# EAGLE design stackclock_display (EAGLE 6.6.0)

## Sheet 1 of 3: Logic
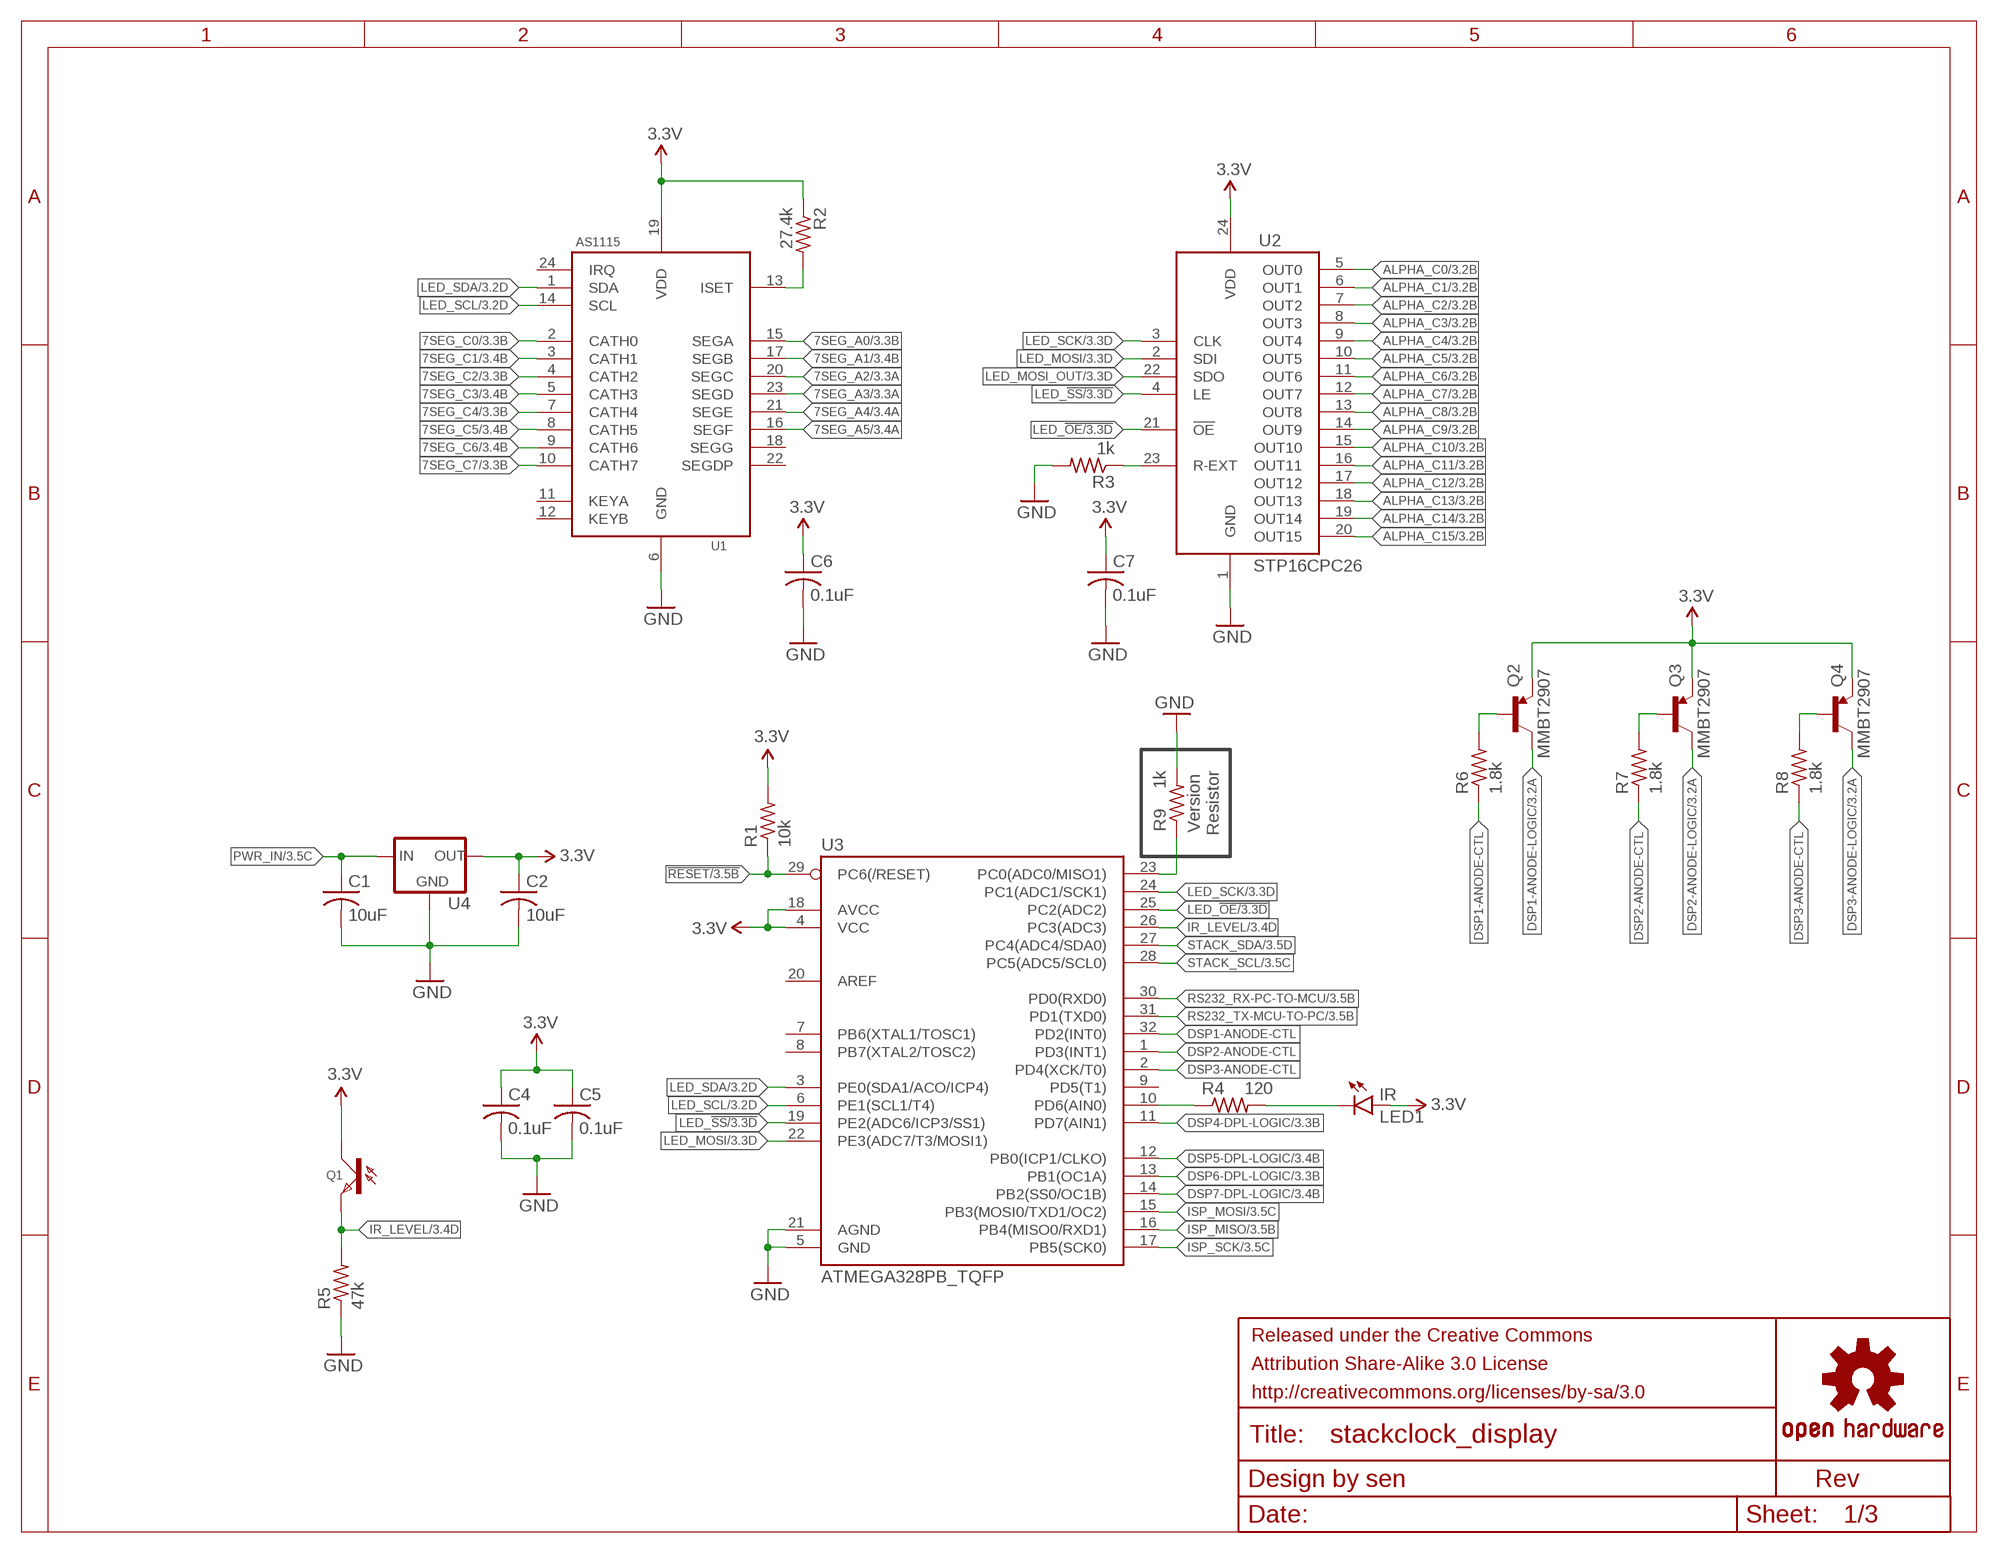
[diagram p0: schematic, sheet 1]

### Parts
C1  10uF  C-USC0805  [C0805]
C2  10uF  C-USC0805  [C0805]
C4  0.1uF  C-USC0603  [C0603]
C5  0.1uF  C-USC0603  [C0603]
C6  0.1uF  C-USC0603  [C0603]
C7  0.1uF  C-USC0603  [C0603]
FRAME1  FRAME-LETTER-GRID-OSHW-SENOSHW-LOGO-L  [OSHW-LOGO-L]
LED1  IR  LED1206  [LED-1206]
Q1  PT15-21C/TR8  [1206_PHOTOTRANSISTOR]
Q2  MMBT2907  TRANSISTOR_PNPSMD  [SOT23-3]
Q3  MMBT2907  TRANSISTOR_PNPSMD  [SOT23-3]
Q4  MMBT2907  TRANSISTOR_PNPSMD  [SOT23-3]
R1  10k  R-US_R0603  [R0603]
R2  27.4k  R-US_R0603  [R0603]
R3  1k  R-US_R0603  [R0603]
R4  120  R-US_R0603  [R0603]
R5  47k  R-US_R0603  [R0603]
R6  1.8k  R-US_R0603  [R0603]
R7  1.8k  R-US_R0603  [R0603]
R8  1.8k  R-US_R0603  [R0603]
R9  1k  R-US_R0603  [R0603]
U1  AS1115  [QSOP24]
U2  STP16CPC26  [TSSOP24]
U3  ATMEGA328PB_TQFP  [TQFP32-08]
U4  NCP1117DT33G  V_REG_MC33269DT  [DPAK]

### Nets
3.3V: C2.1 C4.1 C5.1 C6.1 C7.1 LED1.A Q1.C Q2.2(E) Q3.2(E) Q4.2(E) R1.2 R2.1 U1.19(VDD) U2.24(VDD) U3.4(VCC) U3.18(AVCC) U4.4(OUT) ; also sheet 3
7SEG_A0: U1.15(SEGA) ; also sheet 3
7SEG_A1: U1.17(SEGB) ; also sheet 3
7SEG_A2: U1.20(SEGC) ; also sheet 3
7SEG_A3: U1.23(SEGD) ; also sheet 3
7SEG_A4: U1.21(SEGE) ; also sheet 3
7SEG_A5: U1.16(SEGF) ; also sheet 3
7SEG_C0: U1.2(CATH0) ; also sheet 3
7SEG_C1: U1.3(CATH1) ; also sheet 3
7SEG_C2: U1.4(CATH2) ; also sheet 3
7SEG_C3: U1.5(CATH3) ; also sheet 3
7SEG_C4: U1.7(CATH4) ; also sheet 3
7SEG_C5: U1.8(CATH5) ; also sheet 3
7SEG_C6: U1.9(CATH6) ; also sheet 3
7SEG_C7: U1.10(CATH7) ; also sheet 3
!RESET: R1.1 U3.29(PC6(/RESET)) ; also sheet 3
ALPHA_C0: U2.5(OUT0) ; also sheet 3
ALPHA_C1: U2.6(OUT1) ; also sheet 3
ALPHA_C2: U2.7(OUT2) ; also sheet 3
ALPHA_C3: U2.8(OUT3) ; also sheet 3
ALPHA_C4: U2.9(OUT4) ; also sheet 3
ALPHA_C5: U2.10(OUT5) ; also sheet 3
ALPHA_C6: U2.11(OUT6) ; also sheet 3
ALPHA_C7: U2.12(OUT7) ; also sheet 3
ALPHA_C8: U2.13(OUT8) ; also sheet 3
ALPHA_C9: U2.14(OUT9) ; also sheet 3
ALPHA_C10: U2.15(OUT10) ; also sheet 3
ALPHA_C11: U2.16(OUT11) ; also sheet 3
ALPHA_C12: U2.17(OUT12) ; also sheet 3
ALPHA_C13: U2.18(OUT13) ; also sheet 3
ALPHA_C14: U2.19(OUT14) ; also sheet 3
ALPHA_C15: U2.20(OUT15) ; also sheet 3
DSP1-ANODE-CTL: R6.1 U3.32(PD2(INT0))
DSP1-ANODE-LOGIC: Q2.3(C) ; also sheet 3
DSP1-ANODE-QR: Q2.1(B) R6.2
DSP2-ANODE-CTL: R7.1 U3.1(PD3(INT1))
DSP2-ANODE-LOGIC: Q3.3(C) ; also sheet 3
DSP2-ANODE-QR: Q3.1(B) R7.2
DSP3-ANODE-CTL: R8.1 U3.2(PD4(XCK/T0))
DSP3-ANODE-LOGIC: Q4.3(C) ; also sheet 3
DSP3-ANODE-QR: Q4.1(B) R8.2
DSP4-DPL-LOGIC: U3.11(PD7(AIN1)) ; also sheet 3
DSP5-DPL-LOGIC: U3.12(PB0(ICP1/CLKO)) ; also sheet 3
DSP6-DPL-LOGIC: U3.13(PB1(OC1A)) ; also sheet 3
DSP7-DPL-LOGIC: U3.14(PB2(SS0/OC1B)) ; also sheet 3
GND: C1.2 C2.2 C4.2 C5.2 C6.2 C7.2 R3.2 R5.1 R9.2 U1.6(GND) U2.1(GND) U3.5(GND) U3.21(AGND) U4.1(GND) ; also sheet 3
HW_VERSION: R9.1 U3.23(PC0(ADC0/MISO1))
IR_CTL: R4.1 U3.10(PD6(AIN0))
IR_LEVEL: Q1.E R5.2 U3.26(PC3(ADC3)) ; also sheet 3
IR_R: LED1.C R4.2
ISP_MISO: U3.16(PB4(MISO0/RXD1)) ; also sheet 3
ISP_MOSI: U3.15(PB3(MOSI0/TXD1/OC2)) ; also sheet 3
ISP_SCK: U3.17(PB5(SCK0)) ; also sheet 3
LED_!OE: U2.21(!OE) U3.25(PC2(ADC2)) ; also sheet 3
LED_!SS: U2.4(LE) U3.19(PE2(ADC6/ICP3/SS1)) ; also sheet 3
LED_MOSI: U2.2(SDI) U3.22(PE3(ADC7/T3/MOSI1)) ; also sheet 3
LED_MOSI_OUT: U2.22(SDO) ; also sheet 3
LED_SCK: U2.3(CLK) U3.24(PC1(ADC1/SCK1)) ; also sheet 3
LED_SCL: U1.14(SCL) U3.6(PE1(SCL1/T4)) ; also sheet 3
LED_SDA: U1.1(SDA) U3.3(PE0(SDA1/ACO/ICP4)) ; also sheet 3
PWR_IN: C1.1 U4.3(IN) ; also sheet 3
RS232_RX-PC-TO-MCU: U3.30(PD0(RXD0)) ; also sheet 3
RS232_TX-MCU-TO-PC: U3.31(PD1(TXD0)) ; also sheet 3
STACK_SCL: U3.28(PC5(ADC5/SCL0)) ; also sheet 3
STACK_SDA: U3.27(PC4(ADC4/SDA0)) ; also sheet 3
U1-ISET: R2.2 U1.13(ISET)
U2-REXT: R3.1 U2.23(R-EXT)
Unconnected: U1.11(KEYA) U1.12(KEYB) U1.18(SEGG) U1.22(SEGDP) U1.24(IRQ) U3.7(PB6(XTAL1/TOSC1)) U3.8(PB7(XTAL2/TOSC2)) U3.9(PD5(T1)) U3.20(AREF)

### Notes on the sheet
- Version
  Resistor

## Sheet 2 of 3: Display
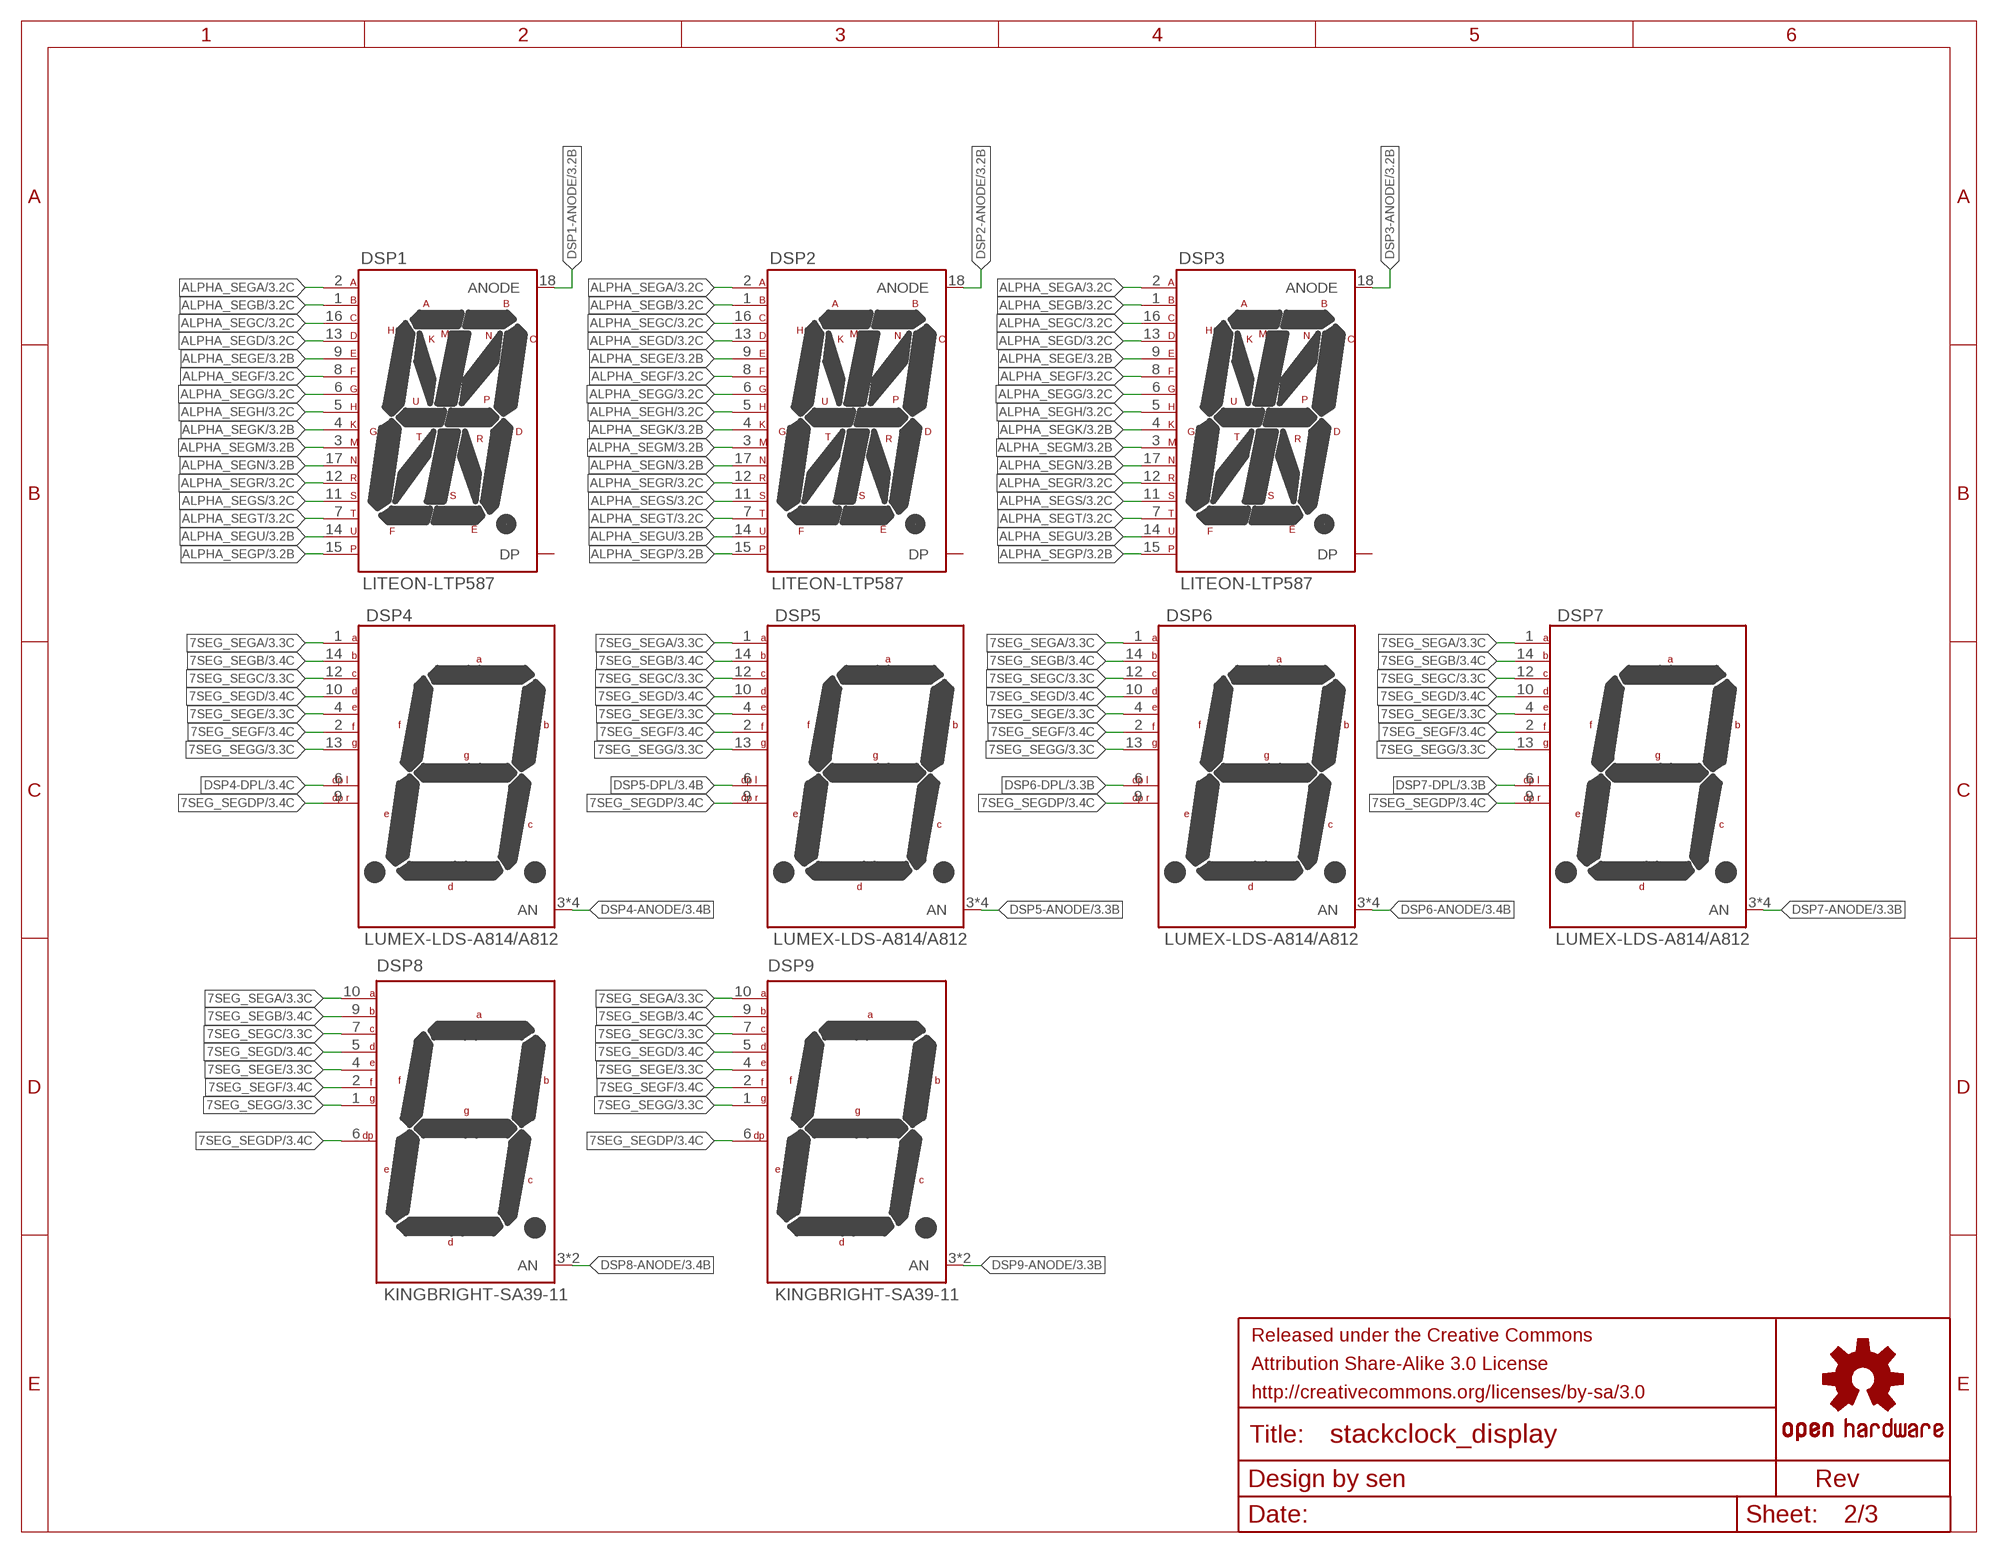
[diagram p1: schematic, sheet 2]

### Parts
DSP1  LITEON-LTP587  [LITEON-LTP587]
DSP2  LITEON-LTP587  [LITEON-LTP587]
DSP3  LITEON-LTP587  [LITEON-LTP587]
DSP4  LUMEX-LDS-A814/A812  [LUMEX-LDS-A814/A812]
DSP5  LUMEX-LDS-A814/A812  [LUMEX-LDS-A814/A812]
DSP6  LUMEX-LDS-A814/A812  [LUMEX-LDS-A814/A812]
DSP7  LUMEX-LDS-A814/A812  [LUMEX-LDS-A814/A812]
DSP8  KINGBRIGHT-SA39-11  [KINGBRIGHT-SA39-11]
DSP9  KINGBRIGHT-SA39-11  [KINGBRIGHT-SA39-11]
FRAME2  FRAME-LETTER-GRID-OSHW-SENOSHW-LOGO-L  [OSHW-LOGO-L]

### Nets
7SEG_SEGA: DSP4.1(A) DSP5.1(A) DSP6.1(A) DSP7.1(A) DSP8.10(A) DSP9.10(A) ; also sheet 3
7SEG_SEGB: DSP4.14(B) DSP5.14(B) DSP6.14(B) DSP7.14(B) DSP8.9(B) DSP9.9(B) ; also sheet 3
7SEG_SEGC: DSP4.12(C) DSP5.12(C) DSP6.12(C) DSP7.12(C) DSP8.7(C) DSP9.7(C) ; also sheet 3
7SEG_SEGD: DSP4.10(D) DSP5.10(D) DSP6.10(D) DSP7.10(D) DSP8.5(D) DSP9.5(D) ; also sheet 3
7SEG_SEGDP: DSP4.9(DP-R) DSP5.9(DP-R) DSP6.9(DP-R) DSP7.9(DP-R) DSP8.6(DP) DSP9.6(DP) ; also sheet 3
7SEG_SEGE: DSP4.4(E) DSP5.4(E) DSP6.4(E) DSP7.4(E) DSP8.4(E) DSP9.4(E) ; also sheet 3
7SEG_SEGF: DSP4.2(F) DSP5.2(F) DSP6.2(F) DSP7.2(F) DSP8.2(F) DSP9.2(F) ; also sheet 3
7SEG_SEGG: DSP4.13(G) DSP5.13(G) DSP6.13(G) DSP7.13(G) DSP8.1(G) DSP9.1(G) ; also sheet 3
ALPHA_SEGA: DSP1.2(A) DSP2.2(A) DSP3.2(A) ; also sheet 3
ALPHA_SEGB: DSP1.1(B) DSP2.1(B) DSP3.1(B) ; also sheet 3
ALPHA_SEGC: DSP1.16(C) DSP2.16(C) DSP3.16(C) ; also sheet 3
ALPHA_SEGD: DSP1.13(D) DSP2.13(D) DSP3.13(D) ; also sheet 3
ALPHA_SEGE: DSP1.9(E) DSP2.9(E) DSP3.9(E) ; also sheet 3
ALPHA_SEGF: DSP1.8(F) DSP2.8(F) DSP3.8(F) ; also sheet 3
ALPHA_SEGG: DSP1.6(G) DSP2.6(G) DSP3.6(G) ; also sheet 3
ALPHA_SEGH: DSP1.5(H) DSP2.5(H) DSP3.5(H) ; also sheet 3
ALPHA_SEGK: DSP1.4(K) DSP2.4(K) DSP3.4(K) ; also sheet 3
ALPHA_SEGM: DSP1.3(M) DSP2.3(M) DSP3.3(M) ; also sheet 3
ALPHA_SEGN: DSP1.17(N) DSP2.17(N) DSP3.17(N) ; also sheet 3
ALPHA_SEGP: DSP1.15(P) DSP2.15(P) DSP3.15(P) ; also sheet 3
ALPHA_SEGR: DSP1.12(R) DSP2.12(R) DSP3.12(R) ; also sheet 3
ALPHA_SEGS: DSP1.11(S) DSP2.11(S) DSP3.11(S) ; also sheet 3
ALPHA_SEGT: DSP1.7(T) DSP2.7(T) DSP3.7(T) ; also sheet 3
ALPHA_SEGU: DSP1.14(U) DSP2.14(U) DSP3.14(U) ; also sheet 3
DSP1-ANODE: DSP1.18(ANODE) ; also sheet 3
DSP2-ANODE: DSP2.18(ANODE) ; also sheet 3
DSP3-ANODE: DSP3.18(ANODE) ; also sheet 3
DSP4-ANODE: DSP4.3(AN) DSP4.5(AN) DSP4.11(AN) DSP4.16(AN) ; also sheet 3
DSP4-DPL: DSP4.6(DP-L) ; also sheet 3
DSP5-ANODE: DSP5.3(AN) DSP5.5(AN) DSP5.11(AN) DSP5.16(AN) ; also sheet 3
DSP5-DPL: DSP5.6(DP-L) ; also sheet 3
DSP6-ANODE: DSP6.3(AN) DSP6.5(AN) DSP6.11(AN) DSP6.16(AN) ; also sheet 3
DSP6-DPL: DSP6.6(DP-L) ; also sheet 3
DSP7-ANODE: DSP7.3(AN) DSP7.5(AN) DSP7.11(AN) DSP7.16(AN) ; also sheet 3
DSP7-DPL: DSP7.6(DP-L) ; also sheet 3
DSP8-ANODE: DSP8.3(AN) DSP8.8(AN) ; also sheet 3
DSP9-ANODE: DSP9.3(AN) DSP9.8(AN) ; also sheet 3
Unconnected: DSP1.10(DP) DSP2.10(DP) DSP3.10(DP)

## Sheet 3 of 3: I/O
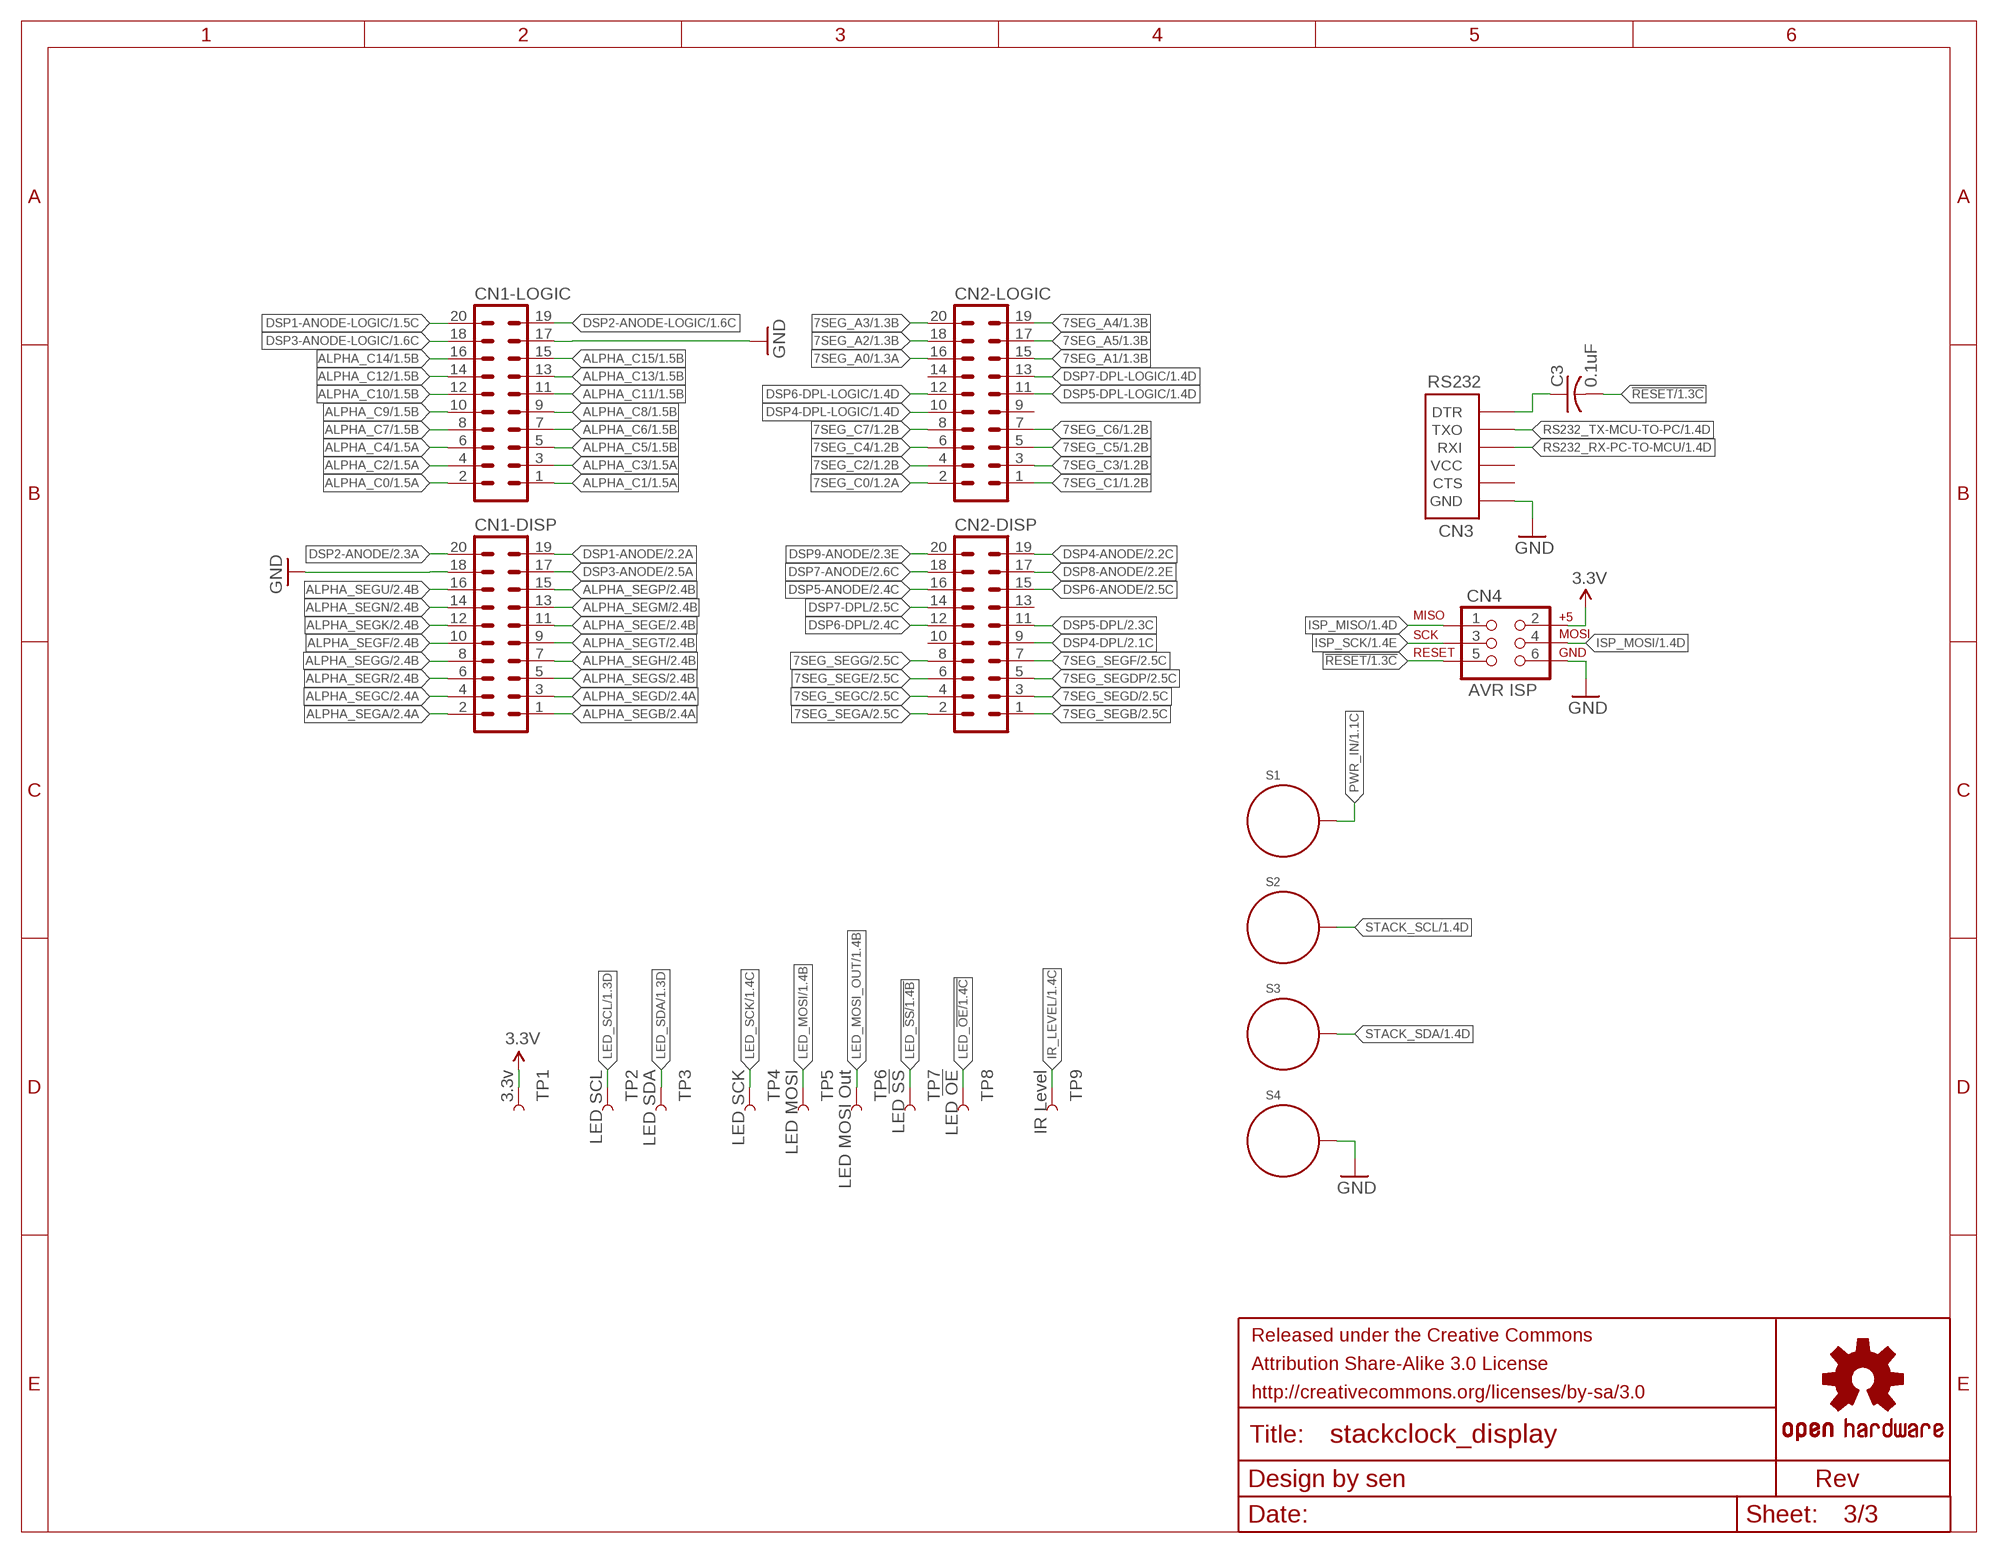
[diagram p2: schematic, sheet 3]

### Parts
C3  0.1uF  C-USC0603  [C0603]
CN1-DISP  MA10-2W  [MA10-2W]
CN1-LOGIC  MA10-2  [MA10-2]
CN2-DISP  MA10-2W  [MA10-2W]
CN2-LOGIC  MA10-2  [MA10-2]
CN3  RS232  FTDI_DEVICE  [FTDI_DEVICE_SIDE]
CN4  AVR ISP  AVR_SPI_PRG_62X3_LOCK  [2X3_LOCK]
FRAME3  FRAME-LETTER-GRID-OSHW-SENOSHW-LOGO-L  [OSHW-LOGO-L]
S1  +V  STANDOFF_ELECTRICAL  [STANDOFF-ELECTRICAL]
S2  SCL  STANDOFF_ELECTRICAL  [STANDOFF-ELECTRICAL]
S3  SDA  STANDOFF_ELECTRICAL  [STANDOFF-ELECTRICAL]
S4  GND  STANDOFF_ELECTRICAL  [STANDOFF-ELECTRICAL]
TP1  3.3v  TEST-POINTTP_15TH_THRU  [TP_15TH]
TP2  LED SCL  TEST-POINTTP_15TH_THRU  [TP_15TH]
TP3  LED SDA  TEST-POINTTP_15TH_THRU  [TP_15TH]
TP4  LED SCK  TEST-POINTTP_15TH_THRU  [TP_15TH]
TP5  LED MOSI  TEST-POINTTP_15TH_THRU  [TP_15TH]
TP6  LED MOSI Out  TEST-POINTTP_15TH_THRU  [TP_15TH]
TP7  LED !SS  TEST-POINTTP_15TH_THRU  [TP_15TH]
TP8  LED !OE  TEST-POINTTP_15TH_THRU  [TP_15TH]
TP9  IR Level  TEST-POINTTP_15TH_THRU  [TP_15TH]

### Nets
3.3V: CN4.2 TP1.P$1 ; also sheet 1
7SEG_A0: CN2-LOGIC.16 ; also sheet 1
7SEG_A1: CN2-LOGIC.15 ; also sheet 1
7SEG_A2: CN2-LOGIC.18 ; also sheet 1
7SEG_A3: CN2-LOGIC.20 ; also sheet 1
7SEG_A4: CN2-LOGIC.19 ; also sheet 1
7SEG_A5: CN2-LOGIC.17 ; also sheet 1
7SEG_C0: CN2-LOGIC.2 ; also sheet 1
7SEG_C1: CN2-LOGIC.1 ; also sheet 1
7SEG_C2: CN2-LOGIC.4 ; also sheet 1
7SEG_C3: CN2-LOGIC.3 ; also sheet 1
7SEG_C4: CN2-LOGIC.6 ; also sheet 1
7SEG_C5: CN2-LOGIC.5 ; also sheet 1
7SEG_C6: CN2-LOGIC.7 ; also sheet 1
7SEG_C7: CN2-LOGIC.8 ; also sheet 1
7SEG_SEGA: CN2-DISP.2 ; also sheet 2
7SEG_SEGB: CN2-DISP.1 ; also sheet 2
7SEG_SEGC: CN2-DISP.4 ; also sheet 2
7SEG_SEGD: CN2-DISP.3 ; also sheet 2
7SEG_SEGDP: CN2-DISP.5 ; also sheet 2
7SEG_SEGE: CN2-DISP.6 ; also sheet 2
7SEG_SEGF: CN2-DISP.7 ; also sheet 2
7SEG_SEGG: CN2-DISP.8 ; also sheet 2
!RESET: C3.2 CN4.5 ; also sheet 1
ALPHA_C0: CN1-LOGIC.2 ; also sheet 1
ALPHA_C1: CN1-LOGIC.1 ; also sheet 1
ALPHA_C2: CN1-LOGIC.4 ; also sheet 1
ALPHA_C3: CN1-LOGIC.3 ; also sheet 1
ALPHA_C4: CN1-LOGIC.6 ; also sheet 1
ALPHA_C5: CN1-LOGIC.5 ; also sheet 1
ALPHA_C6: CN1-LOGIC.7 ; also sheet 1
ALPHA_C7: CN1-LOGIC.8 ; also sheet 1
ALPHA_C8: CN1-LOGIC.9 ; also sheet 1
ALPHA_C9: CN1-LOGIC.10 ; also sheet 1
ALPHA_C10: CN1-LOGIC.12 ; also sheet 1
ALPHA_C11: CN1-LOGIC.11 ; also sheet 1
ALPHA_C12: CN1-LOGIC.14 ; also sheet 1
ALPHA_C13: CN1-LOGIC.13 ; also sheet 1
ALPHA_C14: CN1-LOGIC.16 ; also sheet 1
ALPHA_C15: CN1-LOGIC.15 ; also sheet 1
ALPHA_SEGA: CN1-DISP.2 ; also sheet 2
ALPHA_SEGB: CN1-DISP.1 ; also sheet 2
ALPHA_SEGC: CN1-DISP.4 ; also sheet 2
ALPHA_SEGD: CN1-DISP.3 ; also sheet 2
ALPHA_SEGE: CN1-DISP.11 ; also sheet 2
ALPHA_SEGF: CN1-DISP.10 ; also sheet 2
ALPHA_SEGG: CN1-DISP.8 ; also sheet 2
ALPHA_SEGH: CN1-DISP.7 ; also sheet 2
ALPHA_SEGK: CN1-DISP.12 ; also sheet 2
ALPHA_SEGM: CN1-DISP.13 ; also sheet 2
ALPHA_SEGN: CN1-DISP.14 ; also sheet 2
ALPHA_SEGP: CN1-DISP.15 ; also sheet 2
ALPHA_SEGR: CN1-DISP.6 ; also sheet 2
ALPHA_SEGS: CN1-DISP.5 ; also sheet 2
ALPHA_SEGT: CN1-DISP.9 ; also sheet 2
ALPHA_SEGU: CN1-DISP.16 ; also sheet 2
DSP1-ANODE: CN1-DISP.19 ; also sheet 2
DSP1-ANODE-LOGIC: CN1-LOGIC.20 ; also sheet 1
DSP2-ANODE: CN1-DISP.20 ; also sheet 2
DSP2-ANODE-LOGIC: CN1-LOGIC.19 ; also sheet 1
DSP3-ANODE: CN1-DISP.17 ; also sheet 2
DSP3-ANODE-LOGIC: CN1-LOGIC.18 ; also sheet 1
DSP4-ANODE: CN2-DISP.19 ; also sheet 2
DSP4-DPL: CN2-DISP.9 ; also sheet 2
DSP4-DPL-LOGIC: CN2-LOGIC.10 ; also sheet 1
DSP5-ANODE: CN2-DISP.16 ; also sheet 2
DSP5-DPL: CN2-DISP.11 ; also sheet 2
DSP5-DPL-LOGIC: CN2-LOGIC.11 ; also sheet 1
DSP6-ANODE: CN2-DISP.15 ; also sheet 2
DSP6-DPL: CN2-DISP.12 ; also sheet 2
DSP6-DPL-LOGIC: CN2-LOGIC.12 ; also sheet 1
DSP7-ANODE: CN2-DISP.18 ; also sheet 2
DSP7-DPL: CN2-DISP.14 ; also sheet 2
DSP7-DPL-LOGIC: CN2-LOGIC.13 ; also sheet 1
DSP8-ANODE: CN2-DISP.17 ; also sheet 2
DSP9-ANODE: CN2-DISP.20 ; also sheet 2
GND: CN1-DISP.18 CN1-LOGIC.17 CN3.P$6(GND) CN4.6 S4.P1 ; also sheet 1
IR_LEVEL: TP9.P$1 ; also sheet 1
ISP_MISO: CN4.1 ; also sheet 1
ISP_MOSI: CN4.4 ; also sheet 1
ISP_SCK: CN4.3 ; also sheet 1
LED_!OE: TP8.P$1 ; also sheet 1
LED_!SS: TP7.P$1 ; also sheet 1
LED_MOSI: TP5.P$1 ; also sheet 1
LED_MOSI_OUT: TP6.P$1 ; also sheet 1
LED_SCK: TP4.P$1 ; also sheet 1
LED_SCL: TP2.P$1 ; also sheet 1
LED_SDA: TP3.P$1 ; also sheet 1
PWR_IN: S1.P1 ; also sheet 1
RS232_DTR: C3.1 CN3.P$1(DTR)
RS232_RX-PC-TO-MCU: CN3.P$3(RXI) ; also sheet 1
RS232_TX-MCU-TO-PC: CN3.P$2(TXO) ; also sheet 1
STACK_SCL: S2.P1 ; also sheet 1
STACK_SDA: S3.P1 ; also sheet 1
Unconnected: CN2-DISP.10 CN2-DISP.13 CN2-LOGIC.9 CN2-LOGIC.14 CN3.P$4(VCC) CN3.P$5(CTS)

## Library data of the parts
C1-C7 = rcl:C-US: CAPACITOR, American symbol
CN1-DISP CN2-DISP = con-lstb:MA10-2W: PIN HEADER; OC_FARNELL: unknown; OC_NEWARK: unknown
CN1-LOGIC CN2-LOGIC = con-lstb:MA10-2: PIN HEADER; OC_FARNELL: unknown; OC_NEWARK: unknown
CN3 = SparkFun-Connectors:FTDI_DEVICE: Connector which mates to FTDI basic or FTDI cable.
CN4 = SparkFun-Connectors:AVR_SPI_PRG_6: AVR ISP 6 Pin This is the reduced ISP connector for AVR programming. Common on Arduino. This footprint will take up less PCB space and can be used with a 10-pin to 6-pin adapter such as SKU: BOB-08508 **Special note about "TEST_POINT" package. The stop mask is on the top side, so if you want your programming test points to be on the bottom of your board, make sure to place this package on the bottom side of the board. This also ensure that the orientation to program from the bottom side will be correct.
DSP1-DSP3 = led-sen:LITEON-LTP587: 0.5" 16-segment LED display
DSP4-DSP7 = led-sen:LUMEX-LDS-A814/A812: 7-segment 0.8" display
DSP8 DSP9 = led-sen:KINGBRIGHT-SA39-11: 7-segment 0.39" high display
FRAME1-FRAME3 = logos-sen:FRAME-LETTER-GRID-OSHW-SEN: Landscape letter-sized schematic frame w/ OSHW logo, edge grid; REV: 002
LED1 = SparkFun-LED:LED: LEDs Standard schematic elements and footprints for 5mm, 3mm, 1206, and 0603 sized LEDs. 5mm - Spark Fun Electronics SKU : COM-00529 (and others)
Q1 = transistor-sen:PT15-21C/TR8: 1206 phototransistor
Q2-Q4 = SparkFun-DiscreteSemi:TRANSISTOR_PNP: Generic PNP BJT Double check pinouts against datasheets- not all devices are the same! MMBT3906 - 40V 200mA SOT-23 (TRANS-08052) MMBT4403 - 40V 600mA SOT-23 (TRANS-09245)
R1-R9 = rcl:R-US_: RESISTOR, American symbol
S1-S4 = SparkFun-Electromechanical:STANDOFF_ELECTRICAL: A standoff intended to be an electrically connected point. Pad size and stop size allow for a #4 Phillips pan screw head to make a solid connection to the board.
TP1-TP9 = SparkFun-Passives:TEST-POINT: Bare copper test points for troubleshooting or ICT
U1 = austria-sen:AS1115: austriamicrosystems AS1115 64-channel I2C LED driver. Drives 8x8 matrix or 8x 7-segment displays
U2 = st-sen:STP16CPC26: Low voltage 16-output constant current LED sink driver
U3 = avr-sen:ATMEGA328PB_TQFP; VALUE: ATMEGA328P_TQFP
U4 = SparkFun-PowerIC:V_REG_MC33269

## Board
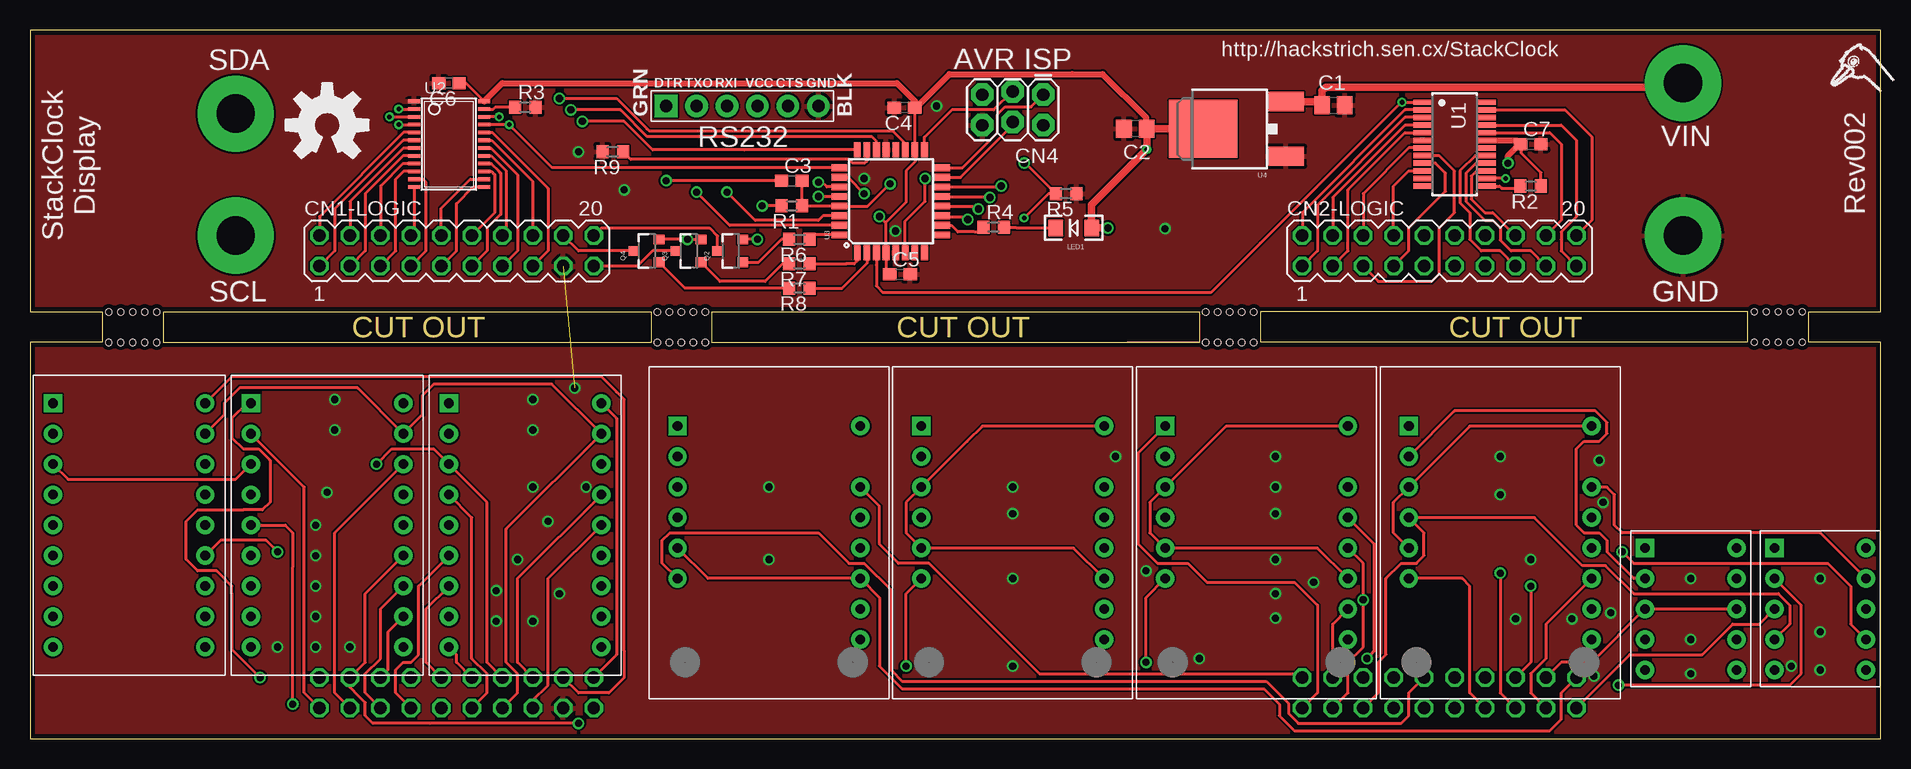
[diagram p3: board, top side]
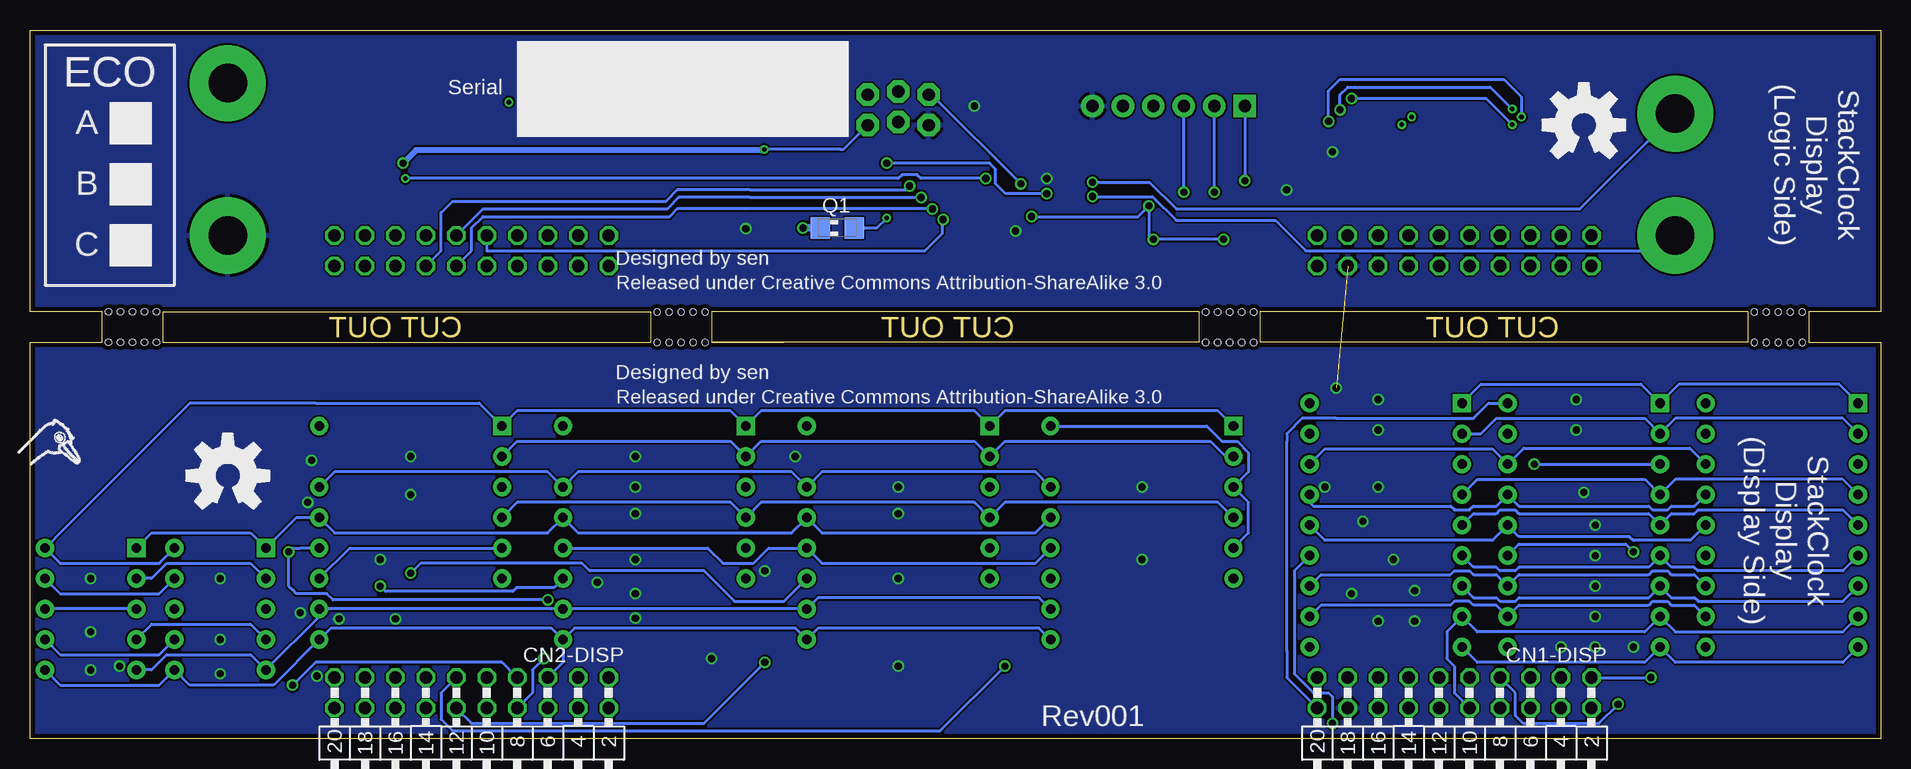
[diagram p4: board, bottom side, seen from below]

Size 154.28 x 59.04 mm. Coordinates in mm from the lower left corner, seen from the top.
Outline: 154.28,27.3 154.28,0 0,0 0,33.02 6.03,33.02 6.03,35.56 0,35.56 0,41.27 0,59.04 154.28,59.04 154.28,41.27 154.28,35.56 148.27,35.56 148.27,33.02 154.28,33.02
Outline: 154.28,27.3 154.28,33.02
Outline: 154.28,27.3 154.28,33.02
Outline: 97.47,33.02 97.47,35.56 56.83,35.56 56.83,33.02 97.47,33.02
Outline: 97.47,33.02 91.44,33.02
Outline: 11.11,35.56 11.11,33.02 51.75,33.02 51.75,35.56 11.11,35.56
Outline: 143.19,33.02 143.19,35.56 102.55,35.56 102.55,33.02 143.19,33.02
Copper layers (1*16): Top 0.0356mm / dielectric 1.5011mm / Bottom 0.0356mm
Design rules "LaenPCBOrder-sen *": minimum track width 6mil, minimum drill 13mil, track to track 6mil, track to pad 6mil, pad to pad 6mil, via to via 6mil, smd to smd 6mil, copper to edge 15mil, drill to drill 6mil, minimum pad ring 7mil, minimum via ring 7mil, stop-mask expansion 4mil, vias tented up to drill 25mil, thermal gap 10mil
Holes 0.5 mm at 6.57,35.55 7.57,35.55 8.57,35.55 9.57,35.55 10.57,35.55 6.57,33.01 7.57,33.01 8.57,33.01 9.57,33.01 10.57,33.01 147.74,33.03 146.74,33.03 145.74,33.03 144.74,33.03 143.74,33.03 147.74,35.57 146.74,35.57 145.74,35.57 144.74,35.57 143.74,35.57 52.29,35.55 53.29,35.55 54.29,35.55 55.29,35.55 56.29,35.55 52.29,33.01 53.29,33.01 54.29,33.01 55.29,33.01 56.29,33.01 98.01,35.55 99.01,35.55 100.01,35.55 101.01,35.55 102.01,35.55 98.01,33.01 99.01,33.01 100.01,33.01 101.01,33.01 102.01,33.01

### Footprints (pad centres in the part's own frame; a part is rotated, then mirrored left to right if it is on the bottom)
C0805 = smd 1.3 x 1.5: 1 -0.95,0; 2 0.95,0
C0603 = smd 1.1 x 1: 1 -0.85,0; 2 0.85,0
MA10-2W = drill 1.016 octagon: 1 -11.43,-1.27; 2 -11.43,1.27; 3 -8.89,-1.27; 4 -8.89,1.27; 5 -6.35,-1.27; 6 -6.35,1.27; 7 -3.81,-1.27; 8 -3.81,1.27; 9 -1.27,-1.27; 10 -1.27,1.27; 11 1.27,-1.27; 12 1.27,1.27; 13 3.81,-1.27; 14 3.81,1.27; 15 6.35,-1.27; 16 6.35,1.27; 17 8.89,-1.27; 18 8.89,1.27; 19 11.43,-1.27; 20 11.43,1.27
MA10-2 = drill 1.016 octagon: 1 -11.43,-1.27; 2 -11.43,1.27; 3 -8.89,-1.27; 4 -8.89,1.27; 5 -6.35,-1.27; 6 -6.35,1.27; 7 -3.81,-1.27; 8 -3.81,1.27; 9 -1.27,-1.27; 10 -1.27,1.27; 11 1.27,-1.27; 12 1.27,1.27; 13 3.81,-1.27; 14 3.81,1.27; 15 6.35,-1.27; 16 6.35,1.27; 17 8.89,-1.27; 18 8.89,1.27; 19 11.43,-1.27; 20 11.43,1.27
FTDI_DEVICE_SIDE = drill 1.016 pad 1.88 square: P$1 -6.35,0 | drill 1.016 pad 1.88: P$2 -3.81,0; P$3 -1.27,0; P$4 1.27,0; P$5 3.81,0; P$6 6.35,0
2X3_LOCK = drill 1.016 pad 1.88 octagon: 1 0,0; 2 0,2.54; 3 2.54,-0.254; 4 2.54,2.286; 5 5.08,0; 6 5.08,2.54
LITEON-LTP587 = drill 0.8 pad 1.524 square: 1 -6.35,10.16 | drill 0.8 pad 1.524: 2 -6.35,7.62; 3 -6.35,5.08; 4 -6.35,2.54; 5 -6.35,0; 6 -6.35,-2.54; 7 -6.35,-5.08; 8 -6.35,-7.62; 9 -6.35,-10.16; 10 6.35,-10.16; 11 6.35,-7.62; 12 6.35,-5.08; 13 6.35,-2.54; 14 6.35,0; 15 6.35,2.54; 16 6.35,5.08; 17 6.35,7.62; 18 6.35,10.16
LUMEX-LDS-A814/A812 = drill 0.8 pad 1.524 square: 1 -7.62,8.89 | drill 0.8 pad 1.524: 2 -7.62,6.35; 3 -7.62,3.81; 4 -7.62,1.27; 5 -7.62,-1.27; 6 -7.62,-3.81; 9 7.62,-8.89; 10 7.62,-6.35; 11 7.62,-3.81; 12 7.62,-1.27; 13 7.62,1.27; 14 7.62,3.81; 16 7.62,8.89
KINGBRIGHT-SA39-11 = drill 0.8 pad 1.524 square: 1 -3.81,5.08 | drill 0.8 pad 1.524: 2 -3.81,2.54; 3 -3.81,0; 4 -3.81,-2.54; 5 -3.81,-5.08; 6 3.81,-5.08; 7 3.81,-2.54; 8 3.81,0; 9 3.81,2.54; 10 3.81,5.08
LED-1206 = smd 1.2 x 1.4: A -1.5,0; C 1.5,0
1206_PHOTOTRANSISTOR = smd 1.6 x 1.803: C -1.422,0; E 1.422,0
SOT23-3 = smd 0.8 x 0.9: 1 -0.95,-1; 2 0.95,-1; 3 0,1.1
R0603 = smd 1 x 1.1: 1 -0.85,0; 2 0.85,0
STANDOFF-ELECTRICAL = drill 3.2 pad 6.35: P1 0,0
TP_15TH = drill 0.381 pad 0.61: P$1 0,0
QSOP24 = smd 0.45 x 1.5: 1 -3.493,-2.69; 2 -2.857,-2.69; 3 -2.223,-2.69; 4 -1.587,-2.69; 5 -0.953,-2.69; 6 -0.318,-2.69; 7 0.318,-2.69; 8 0.953,-2.69; 9 1.587,-2.69; 10 2.223,-2.69; 11 2.857,-2.69; 12 3.493,-2.69; 13 3.493,2.69; 14 2.857,2.69; 15 2.223,2.69; 16 1.587,2.69; 17 0.953,2.69; 18 0.318,2.69; 19 -0.318,2.69; 20 -0.953,2.69; 21 -1.587,2.69; 22 -2.223,2.69; 23 -2.857,2.69; 24 -3.493,2.69
TSSOP24 = smd 0.305 x 0.991: 1 -3.575,-2.918; 2 -2.925,-2.918; 3 -2.275,-2.918; 4 -1.625,-2.918; 5 -0.975,-2.918; 6 -0.325,-2.918; 7 0.325,-2.918; 8 0.975,-2.918; 9 1.625,-2.918; 10 2.275,-2.918; 11 2.925,-2.918; 12 3.575,-2.918; 13 3.575,2.918; 14 2.925,2.918; 15 2.275,2.918; 16 1.625,2.918; 17 0.975,2.918; 18 0.325,2.918; 19 -0.325,2.918; 20 -0.975,2.918; 21 -1.625,2.918; 22 -2.275,2.918; 23 -2.925,2.918; 24 -3.575,2.918
TQFP32-08 = smd 1.27 x 0.559: 1 -4.293,2.8; 2 -4.293,2; 3 -4.293,1.2; 4 -4.293,0.4; 5 -4.293,-0.4; 6 -4.293,-1.2; 7 -4.293,-2; 8 -4.293,-2.8; 17 4.293,-2.8; 18 4.293,-2; 19 4.293,-1.2; 20 4.293,-0.4; 21 4.293,0.4; 22 4.293,1.2; 23 4.293,2; 24 4.293,2.8 | smd 0.559 x 1.27: 9 -2.8,-4.293; 10 -2,-4.293; 11 -1.2,-4.293; 12 -0.4,-4.293; 13 0.4,-4.293; 14 1.2,-4.293; 15 2,-4.293; 16 2.8,-4.293; 25 2.8,4.293; 26 2,4.293; 27 1.2,4.293; 28 0.4,4.293; 29 -0.4,4.293; 30 -1.2,4.293; 31 -2,4.293; 32 -2.8,4.293
DPAK = smd 1.6 x 3: 1 -2.28,-5.31; 3 2.28,-5.31 | smd 4.826 x 5.715: 4 0,1.588

### Placement (x,y rotation side)
C1  108.65,52.77 0 top
C2  92.14,50.8 180 top
C3  63.5,46.48 0 top
C4  72.9,52.58 180 top
C5  72.52,38.67 0 top
C6  34.92,54.61 180 top
C7  125.09,49.53 0 top
CN1-DISP  35.56,3.81 180 bottom
CN1-LOGIC  35.56,40.64 0 top
CN2-DISP  117.47,3.81 180 bottom
CN2-LOGIC  117.47,40.64 0 top
CN3  59.37,52.7 0 top
CN4  84.45,53.66 180 top
DSP1  41.27,17.78 0 top
DSP2  24.77,17.78 0 top
DSP3  8.26,17.78 0 top
DSP4  61.59,17.14 0 top
DSP5  81.92,17.14 0 top
DSP6  102.23,17.14 0 top
DSP7  122.56,17.14 0 top
DSP8  138.43,10.79 0 top
DSP9  149.22,10.79 0 top
FRAME1  137.79,21.91 0 bottom
FRAME2  24.77,51.12 0 bottom
FRAME3  24.77,51.12 0 top
LED1  87,42.55 180 top
Q1  87,42.55 0 bottom
Q2  58.42,40.64 90 top
Q3  54.93,40.64 90 top
Q4  51.44,40.64 90 top
R1  63.5,44.39 180 top
R2  125.09,46.04 180 top
R3  41.27,52.6 0 top
R4  80.33,42.61 0 top
R5  86.36,45.4 180 top
R6  64.14,41.59 180 top
R7  64.14,39.56 180 top
R8  64.14,37.53 180 top
R9  48.58,48.9 180 top
S1  137.79,54.61 0 top
S2  17.14,41.91 0 top
S3  17.14,52.07 0 top
S4  137.79,41.91 0 top
TP1  93.09,49.09 0 bottom
TP2  123,46.67 0 bottom
TP3  114.36,53.02 0 bottom
TP4  29.97,51.8 0 bottom
TP5  30.73,52.46 0 bottom
TP6  39.12,51.81 0 bottom
TP7  30.73,51.16 0 bottom
TP8  39.94,51.16 0 bottom
TP9  82.87,43.37 0 bottom
U1  118.75,49.53 270 top
U2  34.92,49.53 270 top
U3  71.75,44.77 90 top
U4  99.38,50.8 90 top
U$1  [STRICH-LOGO-R]  153.35,24.77 315 bottom
U$2  [STRICH-LOGO]  153.03,55.56 40 top

### Tracks (layer width: path | path; a pad name or v marks a point on that pad's centre or on a via)
3.3V  (via drill 0.6)
  Top 0.254: C6.1 36.34,54.61 U2.24 37.87,53.1 | R2.1 125.94,47.16 124.33,48.77 124.33,49.53 | 124.33,49.53 124.33,49.76 | 123.93,49.85 C7.1 124.33,49.53 | C5.1 71.36,38.98 U3.4 71.36,43.03 | 73.79,52.62 C4.1 73.75,50.98 U3.18 73.79,49.03 73.79,48.07 73.03,47.31 73.03,44.7 71.36,43.03 | 73.98,52.7 73.98,52.9 73.79,53.09 | R1.2 v61.02,44.39 | v60.64,41.59 Q2.2 | Q3.2 v54.8,41.59 Q4.2 | 71.36,43.03 71.27,43.03 v70.8,43.5
  Top 0.381: 93.03,50.86 C2.1
  Top 0.508: U1.19 123.93,49.85 | 37.87,53.1 39.37,54.61 72.26,54.61 73.79,53.09 73.79,52.62 | 73.98,52.7 76.64,55.37 86.87,55.37 89.41,55.37 93.03,51.75 93.03,50.86 | v123.19,47.94 123.19,48.58 124.14,49.53 C7.1
  Top 0.635: U4.4 C2.1 TP1.P$1 88.5,44.49 LED1.A v89.85,42.55
  Bottom 0.254: TP1.P$1 86.74,49.09 86.49,49.09 CN4.2 | v54.8,41.59 v60.64,41.59 61.02,41.97 v61.02,44.39 61.91,43.5 v70.8,43.5
  Bottom 0.406: 93.09,49.02 TP1.P$1
  Bottom 0.508: 93.09,49.02 122.11,49.02 v123.19,47.94
  Bottom 0.635: v89.85,42.55 Q1.C
7SEG_A0
  Top 0.254: U1.15 120.59,47.31 120.14,46.86 120.14,44.96 121.28,43.81 121.92,43.81 CN2-LOGIC.16
7SEG_A1
  Top 0.254: U1.17 120.46,48.58 119.19,47.31 119.19,44.64 120.02,43.81 120.02,41.59 120.97,40.64 122.56,40.64 CN2-LOGIC.15
7SEG_A2
  Top 0.254: U1.20 126.68,50.48 127.64,49.53 127.64,43.18 CN2-LOGIC.18
7SEG_A3
  Top 0.254: U1.23 127.95,52.39 130.18,50.16 130.18,43.18 CN2-LOGIC.20
7SEG_A4
  Top 0.254: U1.21 127.64,51.12 128.91,49.85 128.91,43.5 127.64,42.23 127.64,41.59 127.64,40.64 CN2-LOGIC.19
7SEG_A5
  Top 0.254: U1.16 120.52,47.94 119.7,47.12 119.7,44.77 121.28,43.18 121.92,43.18 122.56,42.55 122.56,41.53 123.44,40.64 125.09,40.64 CN2-LOGIC.17
7SEG_C0
  Top 0.254: U1.2 114.62,52.39 106.05,43.81 CN2-LOGIC.2
7SEG_C1
  Top 0.254: U1.3 114.62,51.75 107.31,44.45 107.31,40.64 CN2-LOGIC.1
7SEG_C2
  Top 0.254: U1.4 114.62,51.12 108.58,45.09 CN2-LOGIC.4
7SEG_C3
  Top 0.254: CN2-LOGIC.3 109.86,40.64 109.86,45.72 114.62,50.48 U1.5
7SEG_C4
  Top 0.254: U1.7 114.94,49.21 111.12,45.4 CN2-LOGIC.6
7SEG_C5
  Top 0.254: CN2-LOGIC.5 112.39,38.1 116.84,38.1 117.47,38.73 117.47,42.55 118.75,43.81 118.75,47.31 117.47,48.58 U1.8
7SEG_C6
  Top 0.254: CN2-LOGIC.7 114.94,40.64 114.94,42.55 117.98,45.59 117.98,47.12 117.16,47.94 U1.9
7SEG_C7
  Top 0.254: CN2-LOGIC.8 113.67,46.04 114.94,47.31 U1.10
7SEG_SEGA
  Top 0.254: DSP6.1 92.39,23.81 92.39,16.19 93.98,14.61 96.52,14.61 98.11,13.02 105.41,13.02 107.31,11.11 107.31,3.81 CN2-DISP.2
  Bottom 0.254: DSP4.1 55.24,27.3 73.03,27.3 DSP5.1 75.56,27.3 93.34,27.3 DSP6.1 95.89,27.3 113.67,27.3 DSP7.1 116.84,27.94 130.49,27.94 130.81,27.94 140.97,27.94 151.45,17.46 | DSP8.10 143.51,14.61 151.76,14.61 DSP9.10 151.45,17.46 | 151.13,17.78 151.45,17.46
7SEG_SEGB
  Top 0.254: DSP4.14 70.8,19.37 70.8,16.19 72.39,14.61 74.93,14.61 84.14,5.4 105.73,5.4 CN2-DISP.1 | DSP9.9 149.22,17.14 132.72,17.14 132.08,17.78 132.08,20.32 131.44,20.95 DSP7.14
  Bottom 0.254: DSP4.14 70.48,22.23 88.27,22.23 DSP5.14 90.81,22.23 108.58,22.23 DSP6.14 111.12,22.23 128.91,22.23 DSP7.14 | DSP9.9 152.4,12.7 151.76,12.06 143.51,12.06 DSP8.9
7SEG_SEGC  (via drill 0.6)
  Top 0.254: DSP9.7 151.76,9.53 151.76,12.7 149.86,14.61 133.67,14.61 v132.72,15.56 | CN2-DISP.4 109.22,3.17 109.86,3.81 109.86,6.35 111.12,7.62 v111.12,11.56 111.12,14.61 DSP6.12
  Bottom 0.254: DSP6.12 97.79,15.88 96.52,14.61 93.98,14.61 92.71,15.88 DSP5.12 88.27,14.61 70.48,14.61 DSP4.12 | DSP9.7 151.76,6.99 143.51,6.99 DSP8.7 | DSP7.12 131.76,15.88 132.4,15.88 v132.72,15.56 132.72,12.7 132.4,12.38 132.08,12.06 129.54,12.06 129.03,11.56 v111.12,11.56
7SEG_SEGD
  Top 0.254: CN2-DISP.3 108.58,9.53 DSP6.10
  Bottom 0.254: DSP4.10 70.17,11.75 88.58,11.75 DSP5.10 DSP6.10 110.81,10.79 129.22,10.79 DSP7.10 130.18,10.16 DSP8.5 135.89,6.99 142.88,6.99 144.15,5.71 DSP9.5
7SEG_SEGDP
  Bottom 0.254: DSP4.9 70.17,9.21 88.58,9.21 DSP5.9 90.49,9.21 108.9,9.21 DSP6.9 | DSP6.9 110.81,9.21 129.22,9.21 DSP7.9 133.99,4.45 140.97,4.45 DSP8.6 143.51,4.45 151.76,4.45 DSP9.6 | DSP6.9 109.86,6.35 CN2-DISP.5
7SEG_SEGE
  Top 0.254: DSP9.4 146.69,9.53 146.69,11.11 145.73,12.06 133.67,12.06 131.32,14.41 129.41,14.41 125.41,18.41 DSP7.4 116.2,17.14 116.2,15.24 115.57,14.61 114.3,14.61 113.03,13.34 113.03,6.99 112.39,6.35 112.39,3.81 CN2-DISP.6
  Bottom 0.254: DSP4.4 55.24,19.68 73.03,19.68 DSP5.4 75.56,19.68 93.34,19.68 DSP6.4 95.89,19.68 113.67,19.68 DSP7.4 | DSP9.4 144.15,9.53 135.89,9.53 DSP8.4
7SEG_SEGF  (via drill 0.6)
  Top 0.254: DSP7.2 118.75,27.3 130.49,27.3 131.44,26.35 131.44,25.4 130.81,24.77 129.54,24.77 128.91,24.13 128.91,17.78 129.54,17.14 130.81,17.14 131.44,16.51 131.44,15.56 133.67,13.34 DSP8.2 | DSP9.2 147.64,11.11 147.64,5.4 146.69,4.45 132.72,4.45 | 132.72,4.45 v132.4,4.45 132.72,4.45
  Bottom 0.254: DSP7.2 113.67,24.77 95.89,24.77 DSP6.2 93.34,24.77 75.56,24.77 DSP5.2 73.03,24.77 55.88,24.77 54.61,23.5 DSP4.2 | DSP8.2 135.89,14.61 142.88,14.61 144.15,13.34 DSP9.2 | CN2-DISP.7 114.94,6.35 130.49,6.35 v132.4,4.45
7SEG_SEGG  (via drill 0.6)
  Top 0.254: DSP6.13 112.08,16.19 112.08,7.3 111.76,6.99 v111.44,6.67
  Bottom 0.254: DSP4.13 70.48,17.14 88.27,17.14 DSP5.13 90.81,17.14 108.58,17.14 DSP6.13 111.12,17.14 128.91,17.14 DSP7.13 132.08,18.41 DSP8.1 135.89,17.14 144.15,17.14 DSP9.1 | v111.44,6.67 112.39,5.71 112.39,3.81 CN2-DISP.8
!RESET  (via drill 0.6)
  Top 0.254: C3.2 R1.1 64.37,44.37 U3.29 69.83,44.37 v71.69,46.23
  Bottom 0.254: CN4.5 79.12,53.66 v71.69,46.23
ALPHA_C0
  Top 0.254: U2.5 31.14,50.51 24.13,43.5 CN1-LOGIC.2
ALPHA_C1
  Top 0.254: U2.6 31.12,49.85 25.4,44.13 25.4,40.64 CN1-LOGIC.1
ALPHA_C2
  Top 0.254: U2.7 31.11,49.2 26.67,44.77 CN1-LOGIC.4
ALPHA_C3
  Top 0.254: U2.8 31.09,48.55 27.94,45.4 27.94,40.64 CN1-LOGIC.3
ALPHA_C4
  Top 0.254: U2.9 31.08,47.91 29.21,46.04 CN1-LOGIC.6
ALPHA_C5
  Top 0.254: CN1-LOGIC.5 30.48,40.64 30.48,46.61 31.11,47.24 31.13,47.26 U2.10
ALPHA_C6
  Top 0.254: CN1-LOGIC.7 33.02,40.64 33.02,46.35 32.77,46.61 U2.11
ALPHA_C7
  Top 0.254: U2.12 32.01,42.17 CN1-LOGIC.8
ALPHA_C8
  Top 0.254: CN1-LOGIC.9 35.56,40.64 35.56,44.58 36.96,45.97 37.82,45.97 U2.13
ALPHA_C9
  Top 0.254: CN1-LOGIC.10 34.29,44.2 36.7,46.61 U2.14
ALPHA_C10
  Top 0.254: U2.15 38.47,47.26 38.73,46.99 38.73,43.81 CN1-LOGIC.12
ALPHA_C11
  Top 0.254: U2.16 38.45,47.91 39.05,47.31 39.24,47.12 39.24,43.69 38.1,42.55 38.1,40.64 CN1-LOGIC.11
ALPHA_C12
  Top 0.254: U2.17 38.44,48.55 39.69,47.31 39.69,42.23 CN1-LOGIC.14
ALPHA_C13
  Top 0.254: U2.18 38.42,49.2 40.13,47.5 40.64,46.99 40.64,40.64 CN1-LOGIC.13
ALPHA_C14
  Top 0.254: U2.19 38.47,49.85 41.91,46.42 CN1-LOGIC.16
ALPHA_C15
  Top 0.254: U2.20 38.52,50.51 43.18,45.85 43.18,40.64 CN1-LOGIC.15
ALPHA_SEGA
  Top 0.254: CN1-DISP.2 22.86,3.81 22.86,20.95 DSP2.2
  Bottom 0.254: DSP3.2 3.17,26.67 17.14,26.67 DSP2.2 19.68,26.67 32.07,26.67 33.34,25.4 DSP1.2
ALPHA_SEGB  (via drill 0.6)
  Top 0.254: DSP2.1 18.1,27.94 16.83,26.67 16.83,25.08 17.78,24.13 19.05,24.13 20,23.18 20,19.68 19.37,19.05 17.78,19.05 13.97,19.05 13.02,18.1 13.02,14.92 13.97,13.97 15.56,13.97 15.88,13.65 16.83,12.7 16.83,12.06 16.83,7.43 v19.18,5.08
  Bottom 0.254: DSP3.1 3.49,29.53 16.83,29.53 DSP2.1 20,29.53 33.34,29.53 DSP1.1 | CN1-DISP.1 v19.18,5.08
ALPHA_SEGC
  Top 0.254: CN1-DISP.4 25.4,3.81 25.4,17.14 DSP2.16
  Bottom 0.254: DSP1.16 46.35,24.13 32.38,24.13 DSP2.16 29.78,24.19 15.94,24.19 DSP3.16
ALPHA_SEGD  (via drill 0.6)
  Top 0.254: DSP2.13 27.94,12.06 27.94,6.35 CN1-DISP.3 26.67,4.25 27.37,3.56 | v20.64,15.56 19.68,16.51 15.88,16.51 DSP3.13 | v45.72,1.27 33.34,1.27 28.57,1.27 27.94,1.91 27.94,2.98 27.37,3.56 | 27.37,3.56 27.05,3.87
  Bottom 0.254: DSP2.13 30.16,16.19 21.27,16.19 v20.64,15.56 | DSP1.13 48.9,13.97 48.9,5.4 47.31,3.81 46.04,3.81 45.72,3.49 45.72,1.59 v45.72,1.27
ALPHA_SEGE
  Top 0.254: CN1-DISP.11 35.56,6.35 35.56,6.99 DSP1.9
  Bottom 0.254: DSP3.9 3.17,6.35 17.14,6.35 DSP2.9 19.68,6.35 33.66,6.35 DSP1.9
ALPHA_SEGF
  Bottom 0.254: DSP3.8 3.17,8.89 17.14,8.89 DSP2.8 19.68,8.89 33.66,8.89 DSP1.8 36.2,8.89 36.2,6.67 35.56,6.03 35.56,3.81 CN1-DISP.10
ALPHA_SEGG
  Top 0.254: CN1-DISP.8 30.48,3.81 30.48,5.71 31.11,6.35 31.75,6.35 32.38,6.99 32.38,12.7 DSP1.6
  Bottom 0.254: DSP3.6 3.17,13.97 15.24,13.97 15.56,14.29 17.46,14.29 DSP2.6 19.37,14.29 30.16,14.29 30.48,13.97 31.75,13.97 32.07,14.29 33.97,14.29 DSP1.6
ALPHA_SEGH  (via drill 0.6)
  Top 0.254: v21.91,2.86 21.91,14.29 21.91,17.14 21.27,17.78 DSP2.5
  Bottom 0.254: DSP1.5 33.97,18.73 32.07,18.73 31.75,19.05 30.48,19.05 30.16,18.73 19.37,18.73 DSP2.5 17.46,18.73 15.56,18.73 15.24,19.05 3.17,19.05 DSP3.5 | v21.91,2.86 23.5,1.27 29.84,1.27 30.48,1.91 30.48,3.81 CN1-DISP.7
ALPHA_SEGK
  Top 0.254: CN1-DISP.12 38.1,3.81 38.1,5.4 36.83,6.67 36.83,18.41 DSP1.4
  Bottom 0.254: DSP3.4 3.17,21.59 17.14,21.59 DSP2.4 19.68,21.59 33.66,21.59 DSP1.4
ALPHA_SEGM  (via drill 0.6)
  Top 0.254: DSP3.3 3.17,21.59 17.14,21.59 DSP2.3 | CN1-DISP.13 38.1,6.35 38.1,19.68 DSP1.3 33.66,24.13 30.16,24.13 v28.89,22.86
  Bottom 0.254: v28.89,22.86 DSP2.3
ALPHA_SEGN
  Top 0.254: CN1-DISP.14 40.64,3.81 40.64,5.4 39.69,6.35 39.69,17.46 DSP1.17 43.5,29.53 33.66,29.53 32.7,28.57 32.7,26.99 DSP2.17 27.3,29.21 17.46,29.21 16.19,27.94 16.19,26.99 DSP3.17
ALPHA_SEGP
  Top 0.254: CN1-DISP.15 40.64,6.35 40.64,13.34 DSP1.15
  Bottom 0.254: DSP1.15 47.62,19.68 47.31,19.37 35.88,19.37 35.56,19.05 34.29,19.05 33.97,19.37 32.07,19.37 DSP2.15 30.16,19.37 19.37,19.37 19.05,19.05 17.78,19.05 17.46,19.37 15.56,19.37 DSP3.15
ALPHA_SEGR
  Top 0.254: CN1-DISP.6 27.94,3.81 27.94,5.4 29.21,6.67 29.21,10.79 DSP2.12
  Bottom 0.254: DSP1.12 46.67,13.65 35.88,13.65 35.56,13.97 34.29,13.97 33.97,13.65 32.07,13.65 DSP2.12 30.16,13.65 19.37,13.65 19.05,13.97 17.78,13.97 17.46,13.65 15.56,13.65 DSP3.12
ALPHA_SEGS
  Top 0.254: CN1-DISP.5 29.84,5.71 29.84,8.89 DSP2.11
  Bottom 0.254: DSP1.11 46.67,11.11 35.88,11.11 35.56,11.43 34.29,11.43 33.97,11.11 32.07,11.11 DSP2.11 30.16,11.11 19.37,11.11 19.05,11.43 17.78,11.43 17.46,11.11 15.56,11.11 DSP3.11
ALPHA_SEGT
  Top 0.254: CN1-DISP.9 33.02,6.35 33.02,10.79 DSP1.7
  Bottom 0.254: DSP1.7 33.97,11.75 32.07,11.75 31.75,11.43 30.48,11.43 30.16,11.75 19.37,11.75 DSP2.7 17.46,11.75 15.56,11.75 15.24,11.43 3.17,11.43 DSP3.7
ALPHA_SEGU
  Top 0.254: CN1-DISP.16 41.91,3.17 43.18,4.45 43.18,13.34 DSP1.14
  Bottom 0.254: DSP3.14 15.88,16.51 20.64,16.51 20.95,16.83 30.16,16.83 DSP2.14 32.38,16.51 46.35,16.51 DSP1.14
DSP1-ANODE
  Top 0.254: DSP1.18 48.9,26.67 48.9,6.99 CN1-DISP.19
DSP1-ANODE-CTL
  Top 0.254: U3.32 65.36,41.97 R6.1
DSP1-ANODE-LOGIC
  Top 0.254: CN1-LOGIC.20 47.62,42.55 56.64,42.55 57.28,41.91 57.32,41.87 Q2.3
DSP1-ANODE-QR
  Top 0.254: Q2.1 60.75,39.69 62.65,41.59 R6.2
DSP2-ANODE
  Bottom 0.254: DSP2.18 32.7,27.94 33.97,26.67 45.4,26.67 48.26,26.67 49.53,25.4 49.53,24.77 49.53,7.3 49.53,5.08 CN1-DISP.20
DSP2-ANODE-CTL
  Top 0.254: R7.1 68.04,39.56 68.71,39.56 68.95,39.81 U3.1
DSP2-ANODE-LOGIC
  Top 0.254: Q3.3 51.88,40.64 50.86,39.62 50.61,39.37 CN1-LOGIC.19
DSP2-ANODE-QR
  Top 0.254: R7.2 62.74,39.56 61.28,38.1 57.52,38.1 Q3.1
DSP3-ANODE
  Top 0.254: DSP3.18 16.83,30.16 47.62,30.16 47.94,29.84 48.9,28.89 49.53,28.26 49.53,7.3 49.53,5.08 48.26,3.81 45.72,3.81 CN1-DISP.17
DSP3-ANODE-CTL
  Top 0.254: R8.1 67.69,37.53 69.53,39.37 69.75,39.59 U3.2
DSP3-ANODE-LOGIC
  Top 0.254: Q4.3 45.72,40.64 CN1-LOGIC.18
DSP3-ANODE-QR
  Top 0.254: R8.2 54.6,37.53 Q4.1
DSP4-ANODE
  Top 0.254: CN2-DISP.19 127.64,3.81 127.64,1.59 126.68,0.64 105.41,0.64 104.14,1.91 104.14,2.86 102.87,4.13 72.71,4.13 70.8,6.03 70.8,11.75 DSP4.11 56.52,13.34 DSP4.5
  Bottom 0.254: DSP4.16 56.2,26.04 54.93,24.77 53.66,24.77 52.7,23.81 52.7,22.23 DSP4.3 52.7,19.68 52.7,17.14 DSP4.5
DSP4-DPL
  Top 0.254: DSP4.6 52.7,14.61 52.7,16.51 53.34,17.14 65.72,17.14 68.26,14.61 69.53,14.61 71.75,12.38 71.75,5.71 72.71,4.76 103.06,4.76 104.9,2.92 104.9,2.1 105.73,1.27 113.98,1.27 114.3,1.27 114.94,1.91 114.94,3.81 CN2-DISP.9
DSP4-DPL-LOGIC  (via drill 0.6)
  Top 0.254: U3.11 76.12,43.5 77.92,43.5 v78.17,43.24
  Bottom 0.254: CN2-LOGIC.10 116.2,40.64 79.69,40.64 78.23,42.1 78.23,43.31 v78.17,43.24
DSP5-ANODE  (via drill 0.6)
  Top 0.254: DSP5.16 79.38,26.04 78.11,24.77 75.25,21.91 DSP5.3 73.03,19.68 73.03,17.14 DSP5.5 87,15.88 DSP5.11 | v122.56,13.78 122.56,3.81 CN2-DISP.16
  Bottom 0.254: v122.56,13.78 121.73,14.61 108.27,14.61 107.63,13.97 98.11,13.97 95.57,11.43 91.44,11.43 DSP5.11
DSP5-DPL  (via drill 0.6)
  Top 0.254: v73.03,6.03 73.03,12.06 DSP5.6
  Bottom 0.254: CN2-DISP.11 120.02,3.81 120.02,1.59 119.06,0.64 116.84,0.64 78.42,0.64 v73.03,6.03
DSP5-DPL-LOGIC  (via drill 0.6)
  Top 0.254: U3.12 78.82,44.37 v79.06,44.13
  Bottom 0.254: CN2-LOGIC.11 117.47,40.64 117.47,42.55 116.52,43.5 100.97,43.5 100.33,44.13 94.61,44.13 v79.06,44.13
DSP6-ANODE  (via drill 0.6)
  Top 0.254: DSP6.16 99.69,26.04 DSP6.3 93.34,19.68 93.34,17.14 DSP6.5 107.31,15.88 DSP6.11 | v125.09,12.7 125.09,6.35 CN2-DISP.15
  Bottom 0.254: DSP6.11 110.62,12.57 113.73,12.57 114.05,12.26 124.65,12.26 v125.09,12.7
DSP6-DPL  (via drill 0.6)
  Top 0.254: v93.03,6.35 93.03,11.75 DSP6.6
  Bottom 0.254: CN2-DISP.12 117.47,1.27 98.11,1.27 v93.03,6.35
DSP6-DPL-LOGIC  (via drill 0.6)
  Top 0.254: v80.01,45.09 76.13,45.09 U3.13
  Bottom 0.254: CN2-LOGIC.12 116.52,44.13 101.16,44.13 100.2,45.09 94.3,45.09 v80.01,45.09
DSP7-ANODE
  Top 0.254: DSP7.5 113.67,17.14 113.67,19.68 DSP7.3 120.02,26.04 DSP7.16 | DSP7.11 128.91,12.06 126.36,9.53 126.36,6.67 125.09,5.4 125.09,3.81 CN2-DISP.18
  Bottom 0.254: DSP7.11 127.64,15.88 DSP7.5
DSP7-DPL
  Top 0.254: DSP7.6 119.38,13.34 120.02,12.7 120.02,3.81 CN2-DISP.14
DSP7-DPL-LOGIC  (via drill 0.6)
  Top 0.254: U3.14 80.89,45.97 v80.96,46.04
  Bottom 0.254: CN2-LOGIC.13 120.02,40.64 120.02,42.55 120.02,43.81 119.06,44.77 101.28,44.77 100.33,45.72 94.3,45.72 81.6,45.72 81.28,45.72 v80.96,46.04
DSP8-ANODE
  Top 0.254: DSP8.8 DSP8.3 130.18,6.35 128.59,6.35 127.64,6.35 CN2-DISP.17
DSP9-ANODE
  Top 0.254: DSP9.3 144.15,9.53 141.92,9.53 139.38,6.99 133.35,6.99 CN2-DISP.20
  Bottom 0.254: DSP9.3 DSP9.8
GND  (via drill 0.6)  (1 unrouted)
  other vias: 69.53,46.67 72.14,42.29 122.56,23.5 130.81,23.18 122.56,20.32 125.09,14.92 131.13,19.68 138.43,13.34 138.43,8.26 138.43,5.4 149.22,13.34 149.22,8.89 149.22,5.71 146.81,6.03 107,13.02 103.82,10.03 97.47,6.67 103.82,18.73 103.82,20.95 103.82,23.5 81.92,20.95 81.92,18.73 81.92,13.34 81.92,6.03 61.59,14.92 61.59,20.95 41.91,20.95 41.91,25.72 40.64,14.92 23.81,15.24 24.77,20.51 25.4,25.72 75.56,52.7 94.61,42.48 44.13,12.06 23.81,12.7 23.81,10.16 43.18,18.1 23.81,17.78 46.35,20.95 49.53,45.72 45.4,29.21 41.91,28.26 25.4,28.26 38.86,12.32 38.86,9.78 41.91,9.78 23.81,7.62 20.64,7.62 26.67,7.62 131.76,10.48 123.83,9.97 128.52,9.97 90.49,23.5 93.03,13.97 103.82,14.92 103.82,12.06 130.37,5.21 45.72,48.9
  pour Top: 0,0 0,59.05 154.31,59.05 154.31,0
  pour Bottom: 0,0 0,59.05 154.31,59.05 154.31,0
HW_VERSION
  Top 0.254: U3.23 69.75,48.16 69.53,47.94 68.58,47.94 68.26,48.26 50.06,48.26 R9.1
IR_CTL
  Top 0.254: U3.10 76.8,42.77 76.96,42.61 77.34,42.23 78.74,42.23 79.1,42.23 R4.1
IR_LEVEL  (via drill 0.6)
  Top 0.254: TP9.P$1 84.9,45.4 85.41,45.4 R5.2 82.97,47.94 v82.87,47.94 | U3.26 68.17,46.77 v69.53,45.4
  Bottom 0.254: Q1.E 83.69,42.55 TP9.P$1 | v69.53,45.4 72.96,45.4 73.79,46.23 73.79,47.43 74.3,47.94 v82.87,47.94
IR_R
  Top 0.254: LED1.C 84.54,42.55 82.23,42.55 81.24,42.55 R4.2
ISP_MISO
  Top 0.254: U3.16 77.73,47.57 80.64,50.48 80.64,52.01 81.28,52.64 83.25,52.64 83.44,52.64 CN4.1
ISP_MOSI
  Top 0.254: U3.15 77.56,46.77 81.92,51.12 CN4.4
ISP_SCK
  Top 0.254: CN4.3 81.85,53.91 80.33,52.39 76.83,52.39 74.61,50.16 74.56,50.11 U3.17
LED_!OE
  Top 0.254: TP8.P$1 U2.21 | U3.25 44.08,47.57 43.53,47.57 TP8.P$1 | 40.01,51.12 39.98,51.12 TP8.P$1
LED_!SS  (via drill 0.6)
  Top 0.254: TP7.P$1 U2.4 | U3.19 72.95,49.6 71.94,50.61 59.82,50.61 51.63,50.61 51.44,50.8 48.9,53.34 v44.13,53.34
  Bottom 0.254: v44.13,53.34 32.92,53.34 TP7.P$1
LED_MOSI  (via drill 0.6)
  Top 0.254: TP5.P$1 U2.2 | U3.22 70.56,49.78 70.17,50.16 60.01,50.16 51.44,50.16 49.21,52.39 v45.09,52.39
  Bottom 0.254: TP5.P$1 32.57,54.29 43.81,54.29 44.45,54.29 45.09,53.66 v45.09,52.39
LED_MOSI_OUT
  Top 0.254: TP6.P$1 U2.22
LED_SCK  (via drill 0.6)
  Top 0.254: TP4.P$1 U2.3 | U3.24 59.54,49.06 51.91,49.06 49.53,51.44 v46.04,51.44
  Bottom 0.254: v46.04,51.44 46.04,53.98 45.09,54.93 31.43,54.93 29.97,53.47 TP4.P$1
LED_SCL  (via drill 0.6)
  Top 0.254: TP2.P$1 U1.14 | U3.6 72.95,43.11 74.61,44.77 v74.61,46.67
  Bottom 0.254: v74.61,46.67 80.01,46.67 80.33,46.99 81.6,46.99 81.92,46.67 TP2.P$1
LED_SDA
  Top 0.254: U1.1 TP3.P$1 114.3,53.02 102.55,41.27 98.42,37.15 71.12,37.15 70.56,37.71 70.56,39.44 U3.3
PWR_IN
  Top 0.635: U4.3 107.69,53.08 C1.1 107.7,53.98 108.01,54.29 137.48,54.29 S1.P1
RS232_DTR  (via drill 0.6)
  Top 0.254: C3.1 v53.02,46.48
  Bottom 0.254: CN3.P$1 53.02,46.55 v53.02,46.48
RS232_RX-PC-TO-MCU  (via drill 0.6)
  Top 0.254: U3.30 66.11,43.57 65.72,43.18 60.45,43.18 v58.1,45.53
  Bottom 0.254: v58.1,45.53 CN3.P$3
RS232_TX-MCU-TO-PC  (via drill 0.6)
  Top 0.254: U3.31 58.33,42.77 v55.56,45.53
  Bottom 0.254: v55.56,45.53 CN3.P$2
STACK_SCL  (via drill 0.6)
  Top 0.254: U3.28 v65.72,45.17
  Bottom 0.254: 18.41,40.64 18.26,40.8 | 18.26,40.8 S2.P1 | v65.72,45.17 60.73,45.17 58.74,43.18 50.48,43.18 47.94,40.64 18.41,40.64 | 18.41,40.64 18.26,40.8
STACK_SDA  (via drill 0.6)
  Top 0.254: U3.27 66.43,45.97 66.04,46.35 v65.72,46.35
  Bottom 0.254: v65.72,46.35 60.96,46.35 58.74,44.13 27.62,44.13 25.08,44.13 S3.P1
U1-ISET
  Top 0.254: U1.13 122.49,46.04 122.68,45.85 124.06,45.85 R2.2
U2-REXT
  Top 0.254: R3.1 38.76,52.6 38.73,52.58 38.61,52.45 U2.23

### Text on the board
Dimension: CUT OUT | CUT OUT | CUT OUT
tPlace: SDA | AVR ISP | http://hackstrich.sen.cx/StackClock | RS232 | VIN | StackClock / Display | Rev002 | SCL | GND
bPlace: ECO | Serial | A | StackClock / Display / (Logic Side) | B | C | Designed by sen | Released under Creative Commons Attribution-ShareAlike 3.0 | Designed by sen | Released under Creative Commons Attribution-ShareAlike 3.0 | StackClock / Display / (Display Side) | Rev001